# Altium project 100862_project.prjpcb (part 1 of 2)
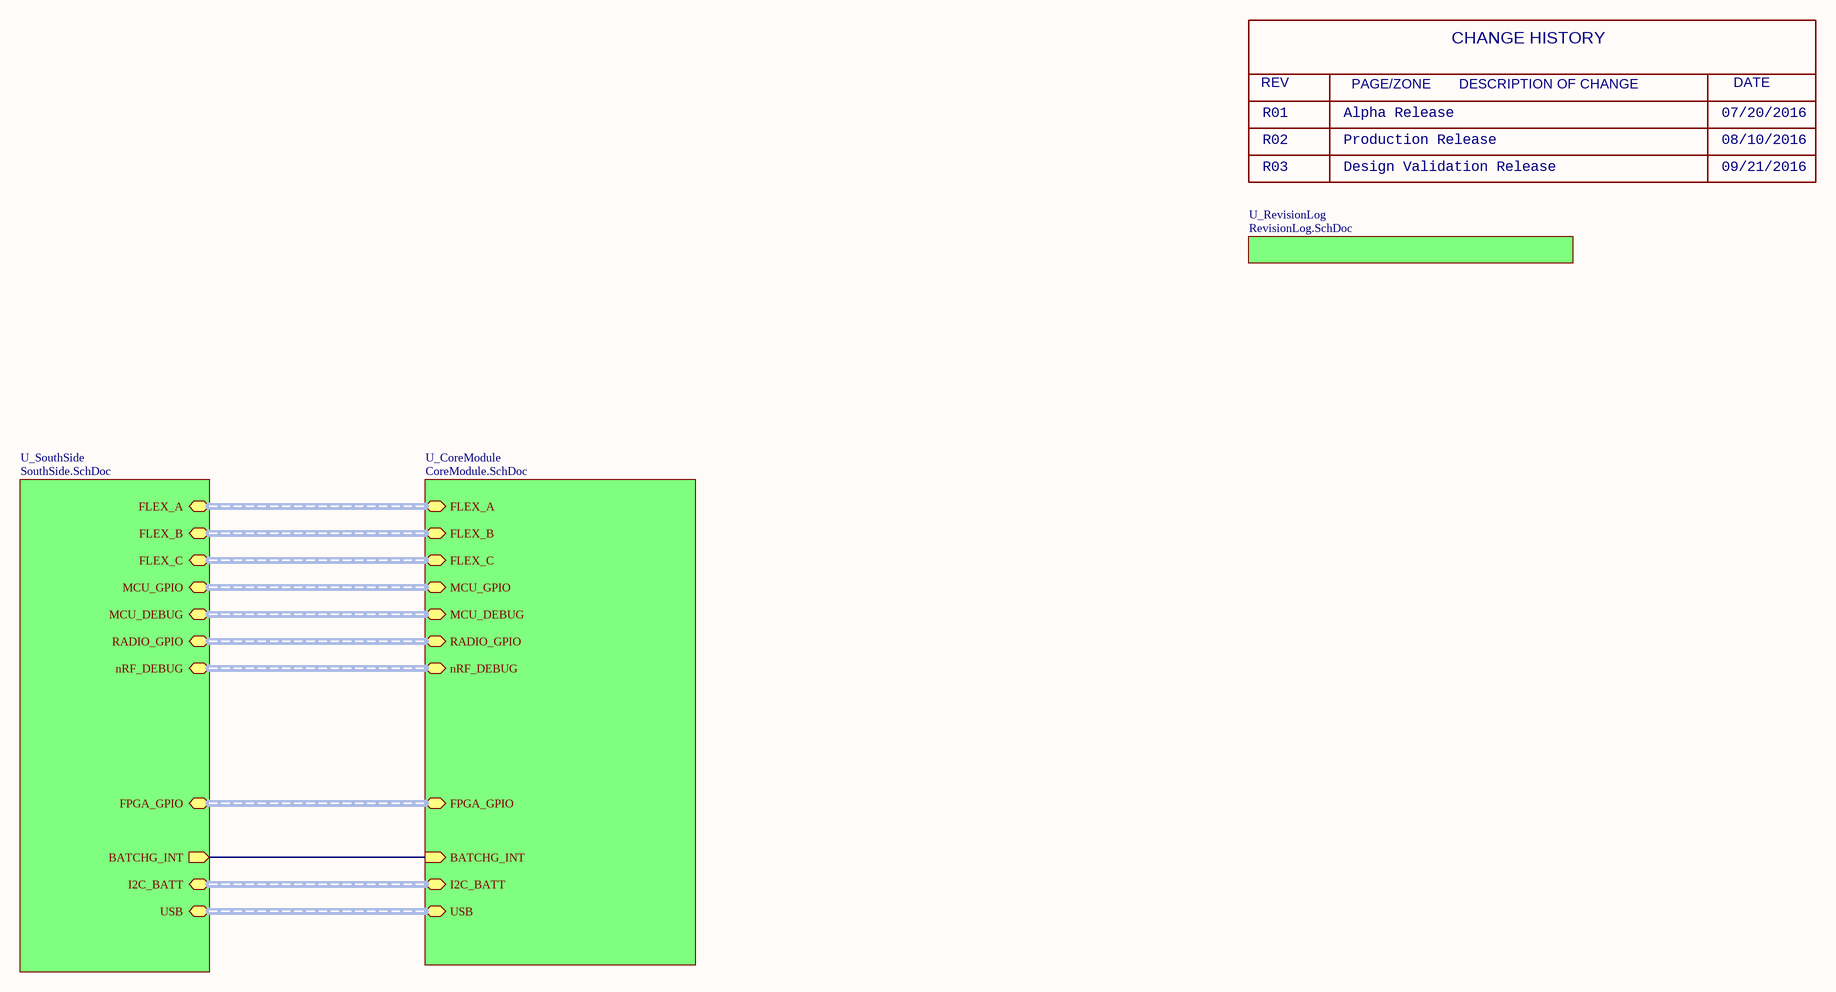
[diagram p0: EvmAppBoard.SchDoc]
Board_Name: EVM Application Board; Board_Number: 100862; PCB_Revision: 03; Project_Name: Ventriloquist; Sch_Revision: 03
7 sheets, 185 parts. Net scope: hierarchical (ports join the sheet entries above them; power ports are global).
Board file: 100862.PcbDoc
Sheets:
  EvmAppBoard.SchDoc
    U_CoreModule = CoreModule.SchDoc
    U_SouthSide = SouthSide.SchDoc
      U_Charging = Charging.SchDoc
      U_Regulation = Regulation.SchDoc
      U_Breakout = Breakout.SchDoc
    U_RevisionLog = RevisionLog.SchDoc

## Sheet EvmAppBoard.SchDoc: Block Diagram
size 431 x 279 mm; DrawnBy: D. Bruey, M. Ciuffo; Organization: Synapse Product Development, LLC.; Address1: 1511 6th Ave., Suite 400; Address2: Seattle, Washington 98101; Address3: 206.381.0898; Address4: www.synapse.com; DocumentNumber: 1; SheetNumber: 1; SheetTotal: 7; PageSetup: Record=PageOptions|CenterHorizontal=True|CenterVertical=True|PrintScale=1.06|XCorrection=1.00|YCorrection=1.00|PrintKind=1|BorderSize=5000000|LeftOffset=0|BottomOffset=0|Orientation=2|PaperLength=4318|PaperWidth=2794|Scale=100|PaperSource=7|PrintQuality=200|MediaType=1|DitherType=10|PrintScaleMode=1|PaperKind=11x17|PaperIndex=3

### Sub-sheets
U_CoreModule = CoreModule.SchDoc: I2C_BATT (harness I2C), MCU_DEBUG (harness SWD), nRF_DEBUG (harness SWD), USB (harness USB), MCU_GPIO (harness MCU_IO), FLEX_C (harness SPI), FLEX_B (harness SPI), FLEX_A (harness SPI), BATCHG_INT (in), FPGA_GPIO (harness FPGA_IO), RADIO_GPIO (harness RADIO_IO)
U_RevisionLog = RevisionLog.SchDoc: no entries
U_SouthSide = SouthSide.SchDoc: I2C_BATT (harness I2C), MCU_DEBUG (harness SWD), nRF_DEBUG (harness SWD), USB (harness USB), MCU_GPIO (harness MCU_IO), FLEX_C (harness SPI), FLEX_B (harness SPI), FLEX_A (harness SPI), BATCHG_INT (out), FPGA_GPIO (harness FPGA_IO), RADIO_GPIO (harness RADIO_IO)

### Nets
BATCHG_INT: sheet U_CoreModule/BATCHG_INT, sheet U_SouthSide/BATCHG_INT

### Buses and harness runs
harness sheet U_CoreModule/FLEX_A = sheet U_SouthSide/FLEX_A
harness sheet U_CoreModule/FLEX_B = sheet U_SouthSide/FLEX_B
harness sheet U_CoreModule/FLEX_C = sheet U_SouthSide/FLEX_C
harness sheet U_CoreModule/FPGA_GPIO = sheet U_SouthSide/FPGA_GPIO
harness sheet U_CoreModule/I2C_BATT = sheet U_SouthSide/I2C_BATT
harness sheet U_CoreModule/MCU_DEBUG = sheet U_SouthSide/MCU_DEBUG
harness sheet U_CoreModule/MCU_GPIO = sheet U_SouthSide/MCU_GPIO
harness sheet U_CoreModule/nRF_DEBUG = sheet U_SouthSide/nRF_DEBUG
harness sheet U_CoreModule/RADIO_GPIO = sheet U_SouthSide/RADIO_GPIO
harness sheet U_CoreModule/USB = sheet U_SouthSide/USB

### Notes on the sheet
- REV
- PAGE/ZONE       DESCRIPTION OF CHANGE
- CHANGE HISTORY
- DATE
- R01
- R02
- R03
- Alpha Release
- Production Release
- Design Validation Release
- 07/20/2016
- 08/10/2016
- 09/21/2016
- Design Notes:
- Layout Notes:
- Project:
- Sheet Title:
- PCBA:
- PROPRIETARY AND CONFIDENTIAL
- Drawn by:
- Schematic Part Number:
- Schematic Revision:
- Date:
- Sheet:
- /

## Sheet CoreModule.SchDoc: Core Module
size 431 x 279 mm; DrawnBy: D. Bruey, M. Ciuffo; Organization: Synapse Product Development, LLC.; Address1: 1511 6th Ave., Suite 400; Address2: Seattle, Washington 98101; Address3: 206.381.0898; Address4: www.synapse.com; SheetNumber: 2; SheetTotal: 7; PageSetup: Record=PageOptions|CenterHorizontal=True|CenterVertical=True|PrintScale=1.06|XCorrection=1.00|YCorrection=1.00|PrintKind=1|BorderSize=5000000|LeftOffset=0|BottomOffset=0|Orientation=2|PaperLength=4318|PaperWidth=2794|Scale=100|PaperSource=7|PrintQuality=200|MediaType=1|DitherType=10|PrintScaleMode=1|PaperKind=11x17|PaperIndex=3
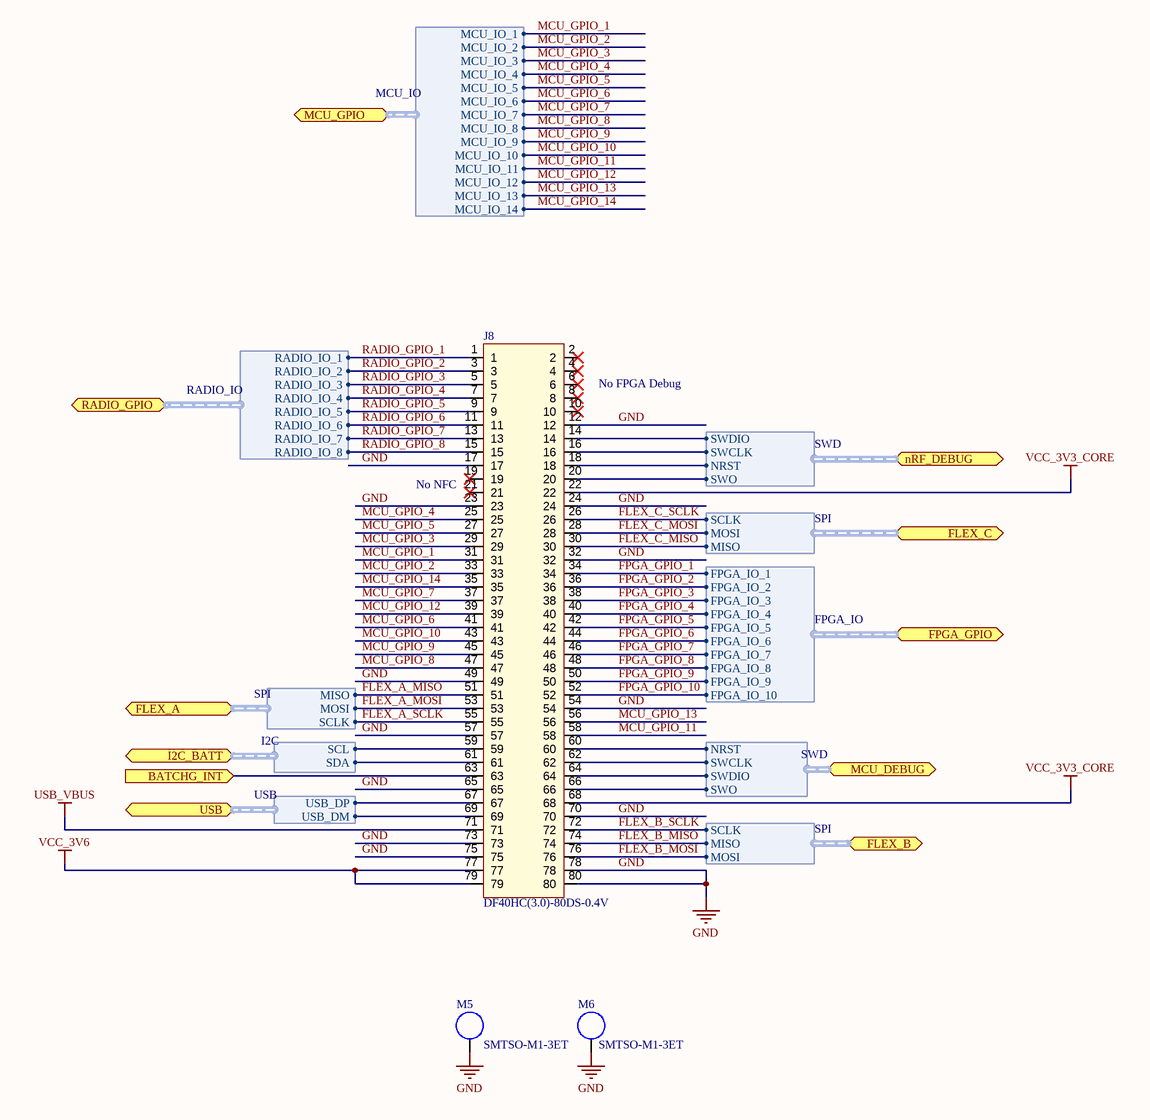
[diagram p1: CoreModule.SchDoc]

### Parts
J8  DF40HC(3.0)-80DS-0.4V  [con80_hirose-df40c-80ds_129h]
M5  SMTSO-M1-3ET  [standoff_hole2p50p]
M6  SMTSO-M1-3ET  [standoff_hole2p50p]

### Ports
BATCHG_INT (in), FLEX_A (harness SPI), FLEX_B (harness SPI), FLEX_C (harness SPI), FPGA_GPIO (harness FPGA_IO), I2C_BATT (harness I2C), MCU_DEBUG (harness SWD), MCU_GPIO (harness MCU_IO), nRF_DEBUG (harness SWD), RADIO_GPIO (harness RADIO_IO), USB (harness USB)

### Harnesses
SPI: MOSI, MISO, SCLK
USB: USB_DM, USB_DP
I2C: SDA, SCL
SWD: NRST, SWCLK, SWDIO, SWO
MCU_IO: MCU_IO_1, MCU_IO_2, MCU_IO_3, MCU_IO_4, MCU_IO_5, MCU_IO_6, MCU_IO_7, MCU_IO_8, MCU_IO_9, MCU_IO_10, MCU_IO_11, MCU_IO_12, MCU_IO_13, MCU_IO_14
FPGA_IO: FPGA_IO_2, FPGA_IO_3, FPGA_IO_4, FPGA_IO_5, FPGA_IO_6, FPGA_IO_7, FPGA_IO_8, FPGA_IO_9, FPGA_IO_10, FPGA_IO_1
RADIO_IO: RADIO_IO_1, RADIO_IO_2, RADIO_IO_3, RADIO_IO_4, RADIO_IO_5, RADIO_IO_6, RADIO_IO_7, RADIO_IO_8

### Nets
GND: J8.12 J8.17 J8.23 J8.24 J8.32 J8.49 J8.54 J8.57 J8.65 J8.70 J8.73 J8.75 J8.78 J8.80 M5.1 M6.1
USB_VBUS: J8.71
VCC_3V3_CORE: J8.22 J8.68
VCC_3V6: J8.77 J8.79
BATCHG_INT: J8.63 ; port BATCHG_INT
FLEX_A_MISO: J8.51 ; port FLEX_A.MISO
FLEX_A_MOSI: J8.53 ; port FLEX_A.MOSI
FLEX_A_SCLK: J8.55 ; port FLEX_A.SCLK
FLEX_B_MISO: J8.74 ; port FLEX_B.MISO
FLEX_B_MOSI: J8.76 ; port FLEX_B.MOSI
FLEX_B_SCLK: J8.72 ; port FLEX_B.SCLK
FLEX_C_MISO: J8.30 ; port FLEX_C.MISO
FLEX_C_MOSI: J8.28 ; port FLEX_C.MOSI
FLEX_C_SCLK: J8.26 ; port FLEX_C.SCLK
FPGA_GPIO_1: J8.34 ; port FPGA_GPIO.FPGA_IO_1
FPGA_GPIO_2: J8.36 ; port FPGA_GPIO.FPGA_IO_2
FPGA_GPIO_3: J8.38 ; port FPGA_GPIO.FPGA_IO_3
FPGA_GPIO_4: J8.40 ; port FPGA_GPIO.FPGA_IO_4  [project net 3V3_APP_nEN]
FPGA_GPIO_5: J8.42 ; port FPGA_GPIO.FPGA_IO_5
FPGA_GPIO_6: J8.44 ; port FPGA_GPIO.FPGA_IO_6
FPGA_GPIO_7: J8.46 ; port FPGA_GPIO.FPGA_IO_7
FPGA_GPIO_8: J8.48 ; port FPGA_GPIO.FPGA_IO_8
FPGA_GPIO_9: J8.50 ; port FPGA_GPIO.FPGA_IO_9
FPGA_GPIO_10: J8.52 ; port FPGA_GPIO.FPGA_IO_10
MCU_GPIO_1: J8.31 ; port MCU_GPIO.MCU_IO_1
MCU_GPIO_2: J8.33 ; port MCU_GPIO.MCU_IO_2
MCU_GPIO_3: J8.29 ; port MCU_GPIO.MCU_IO_3  [project net BTN_SYS_MCU]
MCU_GPIO_4: J8.25 ; port MCU_GPIO.MCU_IO_4
MCU_GPIO_5: J8.27 ; port MCU_GPIO.MCU_IO_5
MCU_GPIO_6: J8.41 ; port MCU_GPIO.MCU_IO_6
MCU_GPIO_7: J8.37 ; port MCU_GPIO.MCU_IO_7
MCU_GPIO_8: J8.47 ; port MCU_GPIO.MCU_IO_8
MCU_GPIO_9: J8.45 ; port MCU_GPIO.MCU_IO_9
MCU_GPIO_10: J8.43 ; port MCU_GPIO.MCU_IO_10
MCU_GPIO_11: J8.58 ; port MCU_GPIO.MCU_IO_11  [project net MCU_11/FLASH_NCS]
MCU_GPIO_12: J8.39 ; port MCU_GPIO.MCU_IO_12
MCU_GPIO_13: J8.56 ; port MCU_GPIO.MCU_IO_13
MCU_GPIO_14: J8.35 ; port MCU_GPIO.MCU_IO_14
MCU_nRST: J8.60 ; port MCU_DEBUG.NRST
MCU_SWCLK: J8.62 ; port MCU_DEBUG.SWCLK
MCU_SWDIO: J8.64 ; port MCU_DEBUG.SWDIO
MCU_SWO: J8.66 ; port MCU_DEBUG.SWO
RADIO_GPIO_1: J8.1 ; port RADIO_GPIO.RADIO_IO_1
RADIO_GPIO_2: J8.3 ; port RADIO_GPIO.RADIO_IO_2
RADIO_GPIO_3: J8.5 ; port RADIO_GPIO.RADIO_IO_3
RADIO_GPIO_4: J8.7 ; port RADIO_GPIO.RADIO_IO_4
RADIO_GPIO_5: J8.9 ; port RADIO_GPIO.RADIO_IO_5
RADIO_GPIO_6: J8.11 ; port RADIO_GPIO.RADIO_IO_6
RADIO_GPIO_7: J8.13 ; port RADIO_GPIO.RADIO_IO_7
RADIO_GPIO_8: J8.15 ; port RADIO_GPIO.RADIO_IO_8
RADIO_nRST: J8.18 ; port nRF_DEBUG.NRST
RADIO_SWCLK: J8.16 ; port nRF_DEBUG.SWCLK
RADIO_SWDIO: J8.14 ; port nRF_DEBUG.SWDIO
RADIO_SWO: J8.20 ; port nRF_DEBUG.SWO
SCL: J8.59 ; port I2C_BATT.SCL
SDA: J8.61 ; port I2C_BATT.SDA
USB_D_N: J8.69 ; port USB.USB_DM
USB_D_P: J8.67 ; port USB.USB_DP

Not connected (* = marked no-connect by the designer): J8 2* 4* 6* 8* 10* 19* 21*

### Notes on the sheet
- (near J8) No FPGA Debug
- (near J8) No NFC
- Design Notes:
- Layout Notes:
- Project:
- Sheet Title:
- PCBA:
- PROPRIETARY AND CONFIDENTIAL
- Drawn by:
- Schematic Part Number:
- Schematic Revision:
- Date:
- Sheet:
- /

### Library data of the parts
J8 = DF40HC(3.0)-80DS-0.4V(51): CONN RCPT 80POS 0.4MM SMD GOLD 3.0MM; part_type: connector; id: 1591; mfg: Hirose; dist: Mouser; dist_pn: 798-DF40HC3080D04V51; source_package: DF40C-80DS-0.4V(51); voltage: 30V; positions: 80; TableName: viewAltiumConnectors; mfg_pn: DF40HC(3.0)-80DS-0.4V(51); height: 3.0mm; status: Unknown; datasheet: http://www.hirose.co.jp/cataloge_hp/ed_DF40_20140305.pdf
M5 M6 = SMTSO-M1-3ET: SMT mounted PEM Standoff, M1, length 3mm; part_type: mounting; id: 1166; mfg: Penn Engineering; dist: Hi-Tech Fasteners; TableName: viewAltiumMisc; mfg_pn: SMTSO-M1-3ET; dist_pn: SMTSO-M1-3ET; status: Unknown

## Sheet SouthSide.SchDoc: South Side Connector
size 431 x 279 mm; DrawnBy: D. Bruey, M. Ciuffo; Organization: Synapse Product Development, LLC.; Address1: 1511 6th Ave., Suite 400; Address2: Seattle, Washington 98101; Address3: 206.381.0898; Address4: www.synapse.com; DocumentNumber: 12; SheetNumber: 3; SheetTotal: 7; PageSetup: Record=PageOptions|CenterHorizontal=True|CenterVertical=True|PrintScale=0.95|XCorrection=1.00|YCorrection=1.00|PrintKind=1|BorderSize=5000000|LeftOffset=0|BottomOffset=0|Orientation=2|PaperLength=4318|PaperWidth=2794|Scale=100|PaperSource=7|PrintQuality=200|MediaType=1|DitherType=10|PrintScaleMode=1|PaperKind=11x17|PaperIndex=3
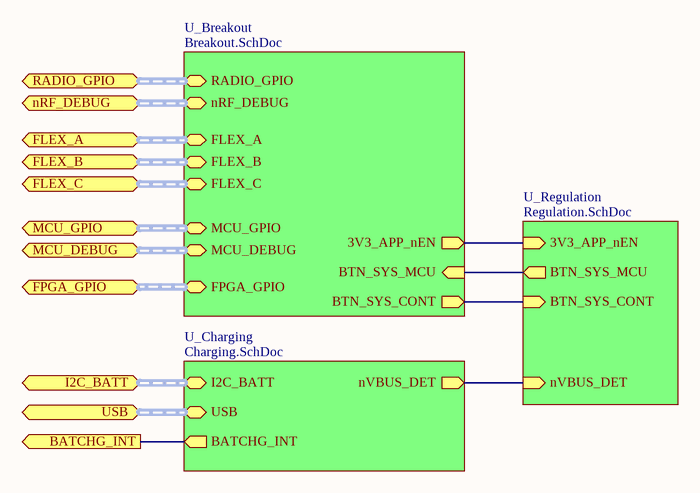
[diagram p2: SouthSide.SchDoc]

### Sub-sheets
U_Breakout = Breakout.SchDoc: FLEX_A (harness SPI), FLEX_B (harness SPI), FLEX_C (harness SPI), MCU_GPIO (harness MCU_IO), MCU_DEBUG (harness SWD), FPGA_GPIO (harness FPGA_IO), nRF_DEBUG (harness SWD), RADIO_GPIO (harness RADIO_IO), BTN_SYS_CONT (out), BTN_SYS_MCU (in), 3V3_APP_nEN (out)
U_Charging = Charging.SchDoc: I2C_BATT (harness I2C), USB (harness USB), BATCHG_INT (out), nVBUS_DET (out)
U_Regulation = Regulation.SchDoc: nVBUS_DET (in), BTN_SYS_CONT (in), BTN_SYS_MCU (out), 3V3_APP_nEN (in)

### Ports
BATCHG_INT (out), FLEX_A (harness SPI), FLEX_B (harness SPI), FLEX_C (harness SPI), FPGA_GPIO (harness FPGA_IO), I2C_BATT (harness I2C), MCU_DEBUG (harness SWD), MCU_GPIO (harness MCU_IO), nRF_DEBUG (harness SWD), RADIO_GPIO (harness RADIO_IO), USB (harness USB)

### Nets
3V3_APP_nEN: sheet U_Regulation/3V3_APP_nEN, sheet U_Breakout/3V3_APP_nEN
BATCHG_INT: port BATCHG_INT, sheet U_Charging/BATCHG_INT
BTN_SYS_CONT: sheet U_Regulation/BTN_SYS_CONT, sheet U_Breakout/BTN_SYS_CONT
BTN_SYS_MCU: sheet U_Regulation/BTN_SYS_MCU, sheet U_Breakout/BTN_SYS_MCU
nVBUS_DET: sheet U_Charging/nVBUS_DET, sheet U_Regulation/nVBUS_DET

### Buses and harness runs
harness port FLEX_A = sheet U_Breakout/FLEX_A
harness port FLEX_B = sheet U_Breakout/FLEX_B
harness port FLEX_C = sheet U_Breakout/FLEX_C
harness port FPGA_GPIO = sheet U_Breakout/FPGA_GPIO
harness port I2C_BATT = sheet U_Charging/I2C_BATT
harness port MCU_DEBUG = sheet U_Breakout/MCU_DEBUG
harness port MCU_GPIO = sheet U_Breakout/MCU_GPIO
harness port nRF_DEBUG = sheet U_Breakout/nRF_DEBUG
harness port RADIO_GPIO = sheet U_Breakout/RADIO_GPIO
harness port USB = sheet U_Charging/USB

### Notes on the sheet
- Design Notes:
- Layout Notes:
- Project:
- Sheet Title:
- PCBA:
- PROPRIETARY AND CONFIDENTIAL
- Drawn by:
- Schematic Part Number:
- Schematic Revision:
- Date:
- Sheet:
- /

## Sheet Charging.SchDoc: Charging
size 431 x 279 mm; DrawnBy: D. Bruey, M. Ciuffo; Organization: Synapse Product Development, LLC.; Address1: 1511 6th Ave., Suite 400; Address2: Seattle, Washington 98101; Address3: 206.381.0898; Address4: www.synapse.com; DocumentNumber: 13; SheetNumber: 5; SheetTotal: 7; PageSetup: Record=PageOptions|CenterHorizontal=True|CenterVertical=True|PrintScale=1.06|XCorrection=1.00|YCorrection=1.00|PrintKind=1|BorderSize=5000000|LeftOffset=0|BottomOffset=0|Orientation=2|PaperLength=4318|PaperWidth=2794|Scale=100|PaperSource=7|PrintQuality=200|MediaType=1|DitherType=10|PrintScaleMode=1|PaperKind=11x17|PaperIndex=3
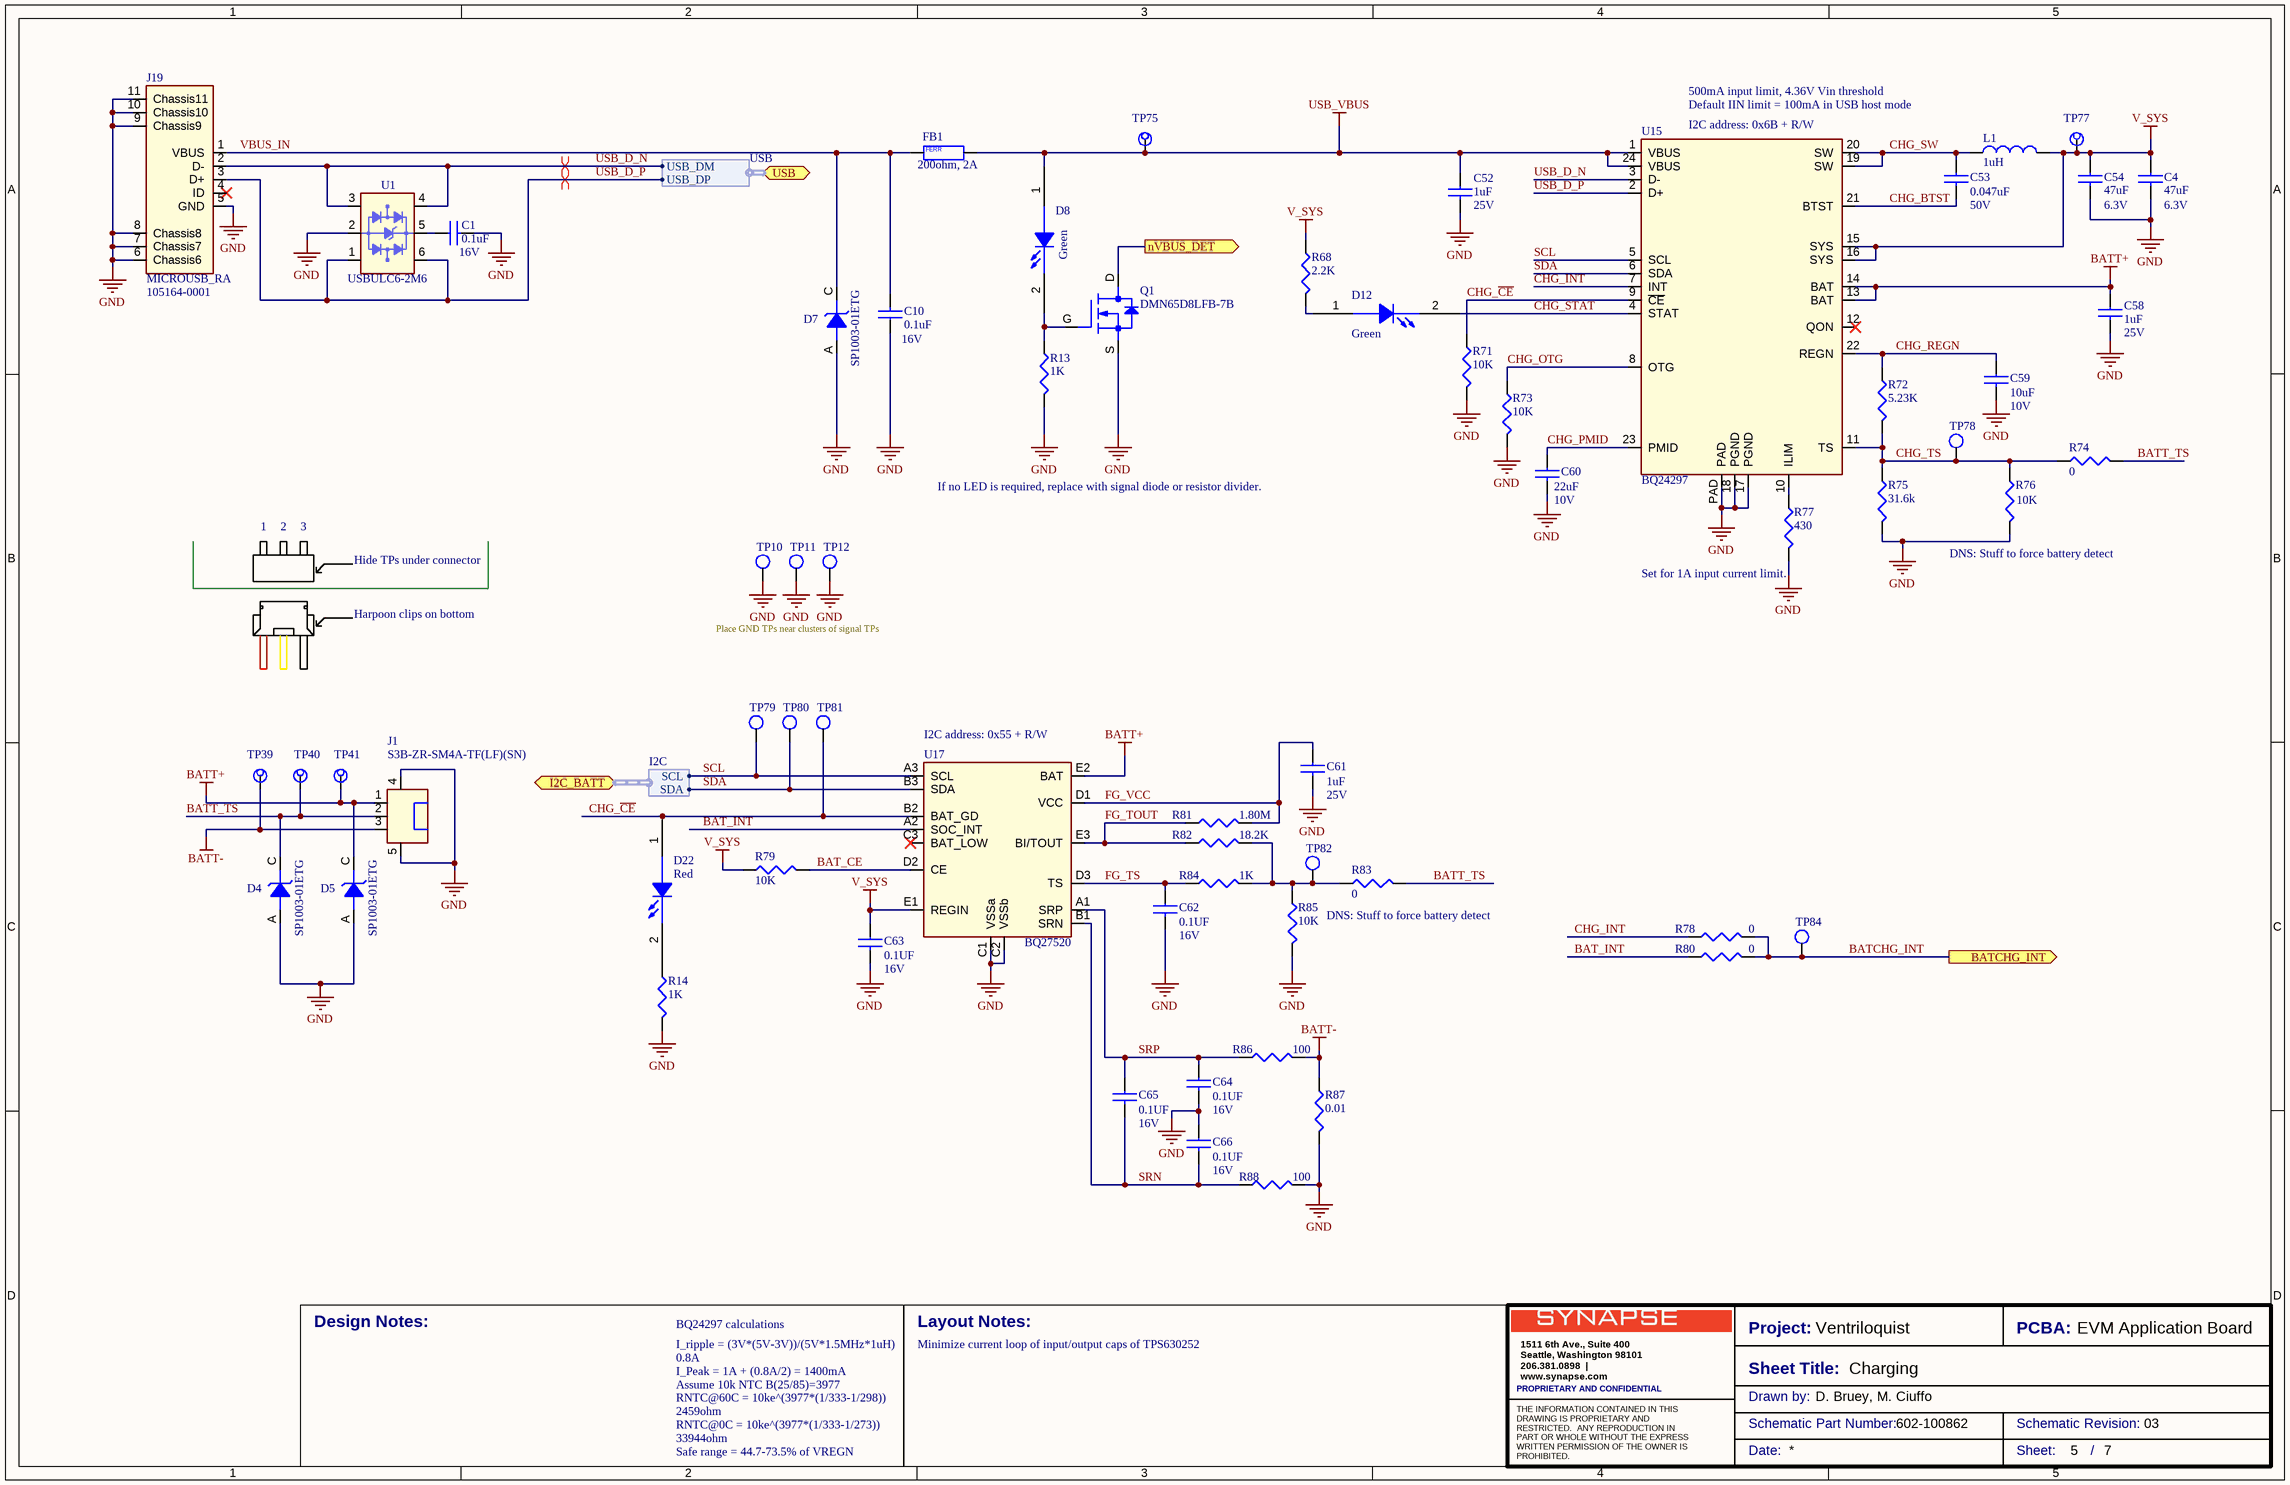
[diagram p3: Charging.SchDoc]

### Parts
C1  0.1uF  Voltage: 16V  [0402-IPCsm_55]
C4  47uF  Voltage: 6.3V  [0805-ipcsm_145]
C10  0.1uF  Voltage: 16V  [0402-IPCsm_55]
C52  1uF  Voltage: 25V  [0603-IPCsm_90]
C53  0.047uF  Voltage: 50V  [0402-IPCsm_55]
C54  47uF  Voltage: 6.3V  [0805-ipcsm_145]
C58  1uF  Voltage: 25V  [0603-IPCsm_90]
C59  10uF  Voltage: 10V  [0402-ipcsm_55]
C60  22uF  Voltage: 10V  [0805-IPCsm_100]
C61  1uF  Voltage: 25V  [0603-IPCsm_90]
C62  0.1UF  Voltage: 16V  [0603-ipcsm_90]
C63  0.1UF  Voltage: 16V  [0603-ipcsm_90]
C64  0.1UF  Voltage: 16V  [0603-ipcsm_90]
C65  0.1UF  Voltage: 16V  [0603-ipcsm_90]
C66  0.1UF  Voltage: 16V  [0603-ipcsm_90]
D4  SP1003-01ETG  [SOD882-60]
D5  SP1003-01ETG  [SOD882-60]
D7  SP1003-01ETG  [SOD882-60]
D8  Green  [led_ltst-c191kgkt_s80]
D12  Green  [led_ltst-c191kgkt_s80]
D22  Red  [LED_LTST-C191KGKT_S80]
FB1  200ohm, 2A  [ind-0603_38H]
J1  S3B-ZR-SM4A-TF(LF)(SN)  [CON_JST_S3B-ZR-SM4A]
J19  MICROUSB_RA  mfg_pn: 105164-0001  [CON_USB_MOLEX_105164-0001]
L1  1uH  [ind-1008_35H]
Q1  DMN65D8LFB-7B  [DFN3-1006_50H]
R13  1K  [0603-IPCsm_56]
R14  1K  [0603-IPCsm_56]
R68  2.2K  [0402-IPCsm_40]
R71  10K  [0402-IPCsm_40]
R72  5.23K  [0402-IPCsm_40]
R73  10K  [0402-IPCsm_40]
R74  0  [0402-IPCsm_40]
R75  31.6k  [0402-IPCsm_40]
R76  10K  [0402-IPCsm_40]
R77  430  [0402-IPCsm_40]
R78  0  [0402-IPCsm_40]
R79  10K  [0402-IPCsm_40]
R80  0  [0402-IPCsm_40]
R81  1.80M  [0603-IPCsm_56]
R82  18.2K  [0603-IPCsm_56]
R83  0  [0402-IPCsm_40]
R84  1K  [0603-IPCsm_56]
R85  10K  [0402-IPCsm_40]
R86  100  [0603-IPCsm_56]
R87  0.01  [r-0805_20H]
R88  100  [0603-IPCsm_56]
TP10  tp-1mm  [TP-S100_SMT]  (value not drawn)  (no BOM)
TP11  tp-1mm  [TP-S100_SMT]  (value not drawn)  (no BOM)
TP12  tp-1mm  [TP-S100_SMT]  (value not drawn)  (no BOM)
TP39  TPC150H080P  [TPC150H080P]  (value not drawn)  (no BOM)
TP40  TPC150H080P  [TPC150H080P]  (value not drawn)  (no BOM)
TP41  TPC150H080P  [TPC150H080P]  (value not drawn)  (no BOM)
TP75  TPC150H080P  [TPC150H080P]  (value not drawn)  (no BOM)
TP77  TPC150H080P  [TPC150H080P]  (value not drawn)  (no BOM)
TP78  tp-1mm  [TP-S100_SMT]  (value not drawn)  (no BOM)
TP79  tp-1mm  [TP-S100_SMT]  (value not drawn)  (no BOM)
TP80  tp-1mm  [TP-S100_SMT]  (value not drawn)  (no BOM)
TP81  tp-1mm  [TP-S100_SMT]  (value not drawn)  (no BOM)
TP82  tp-1mm  [TP-S100_SMT]  (value not drawn)  (no BOM)
TP84  tp-1mm  [TP-S100_SMT]  (value not drawn)  (no BOM)
U1  USBULC6-2M6  [UQFN6_ USBULC6-2M6]
U15  BQ24297  [QFN24_BQ24297RGE]
U17  BQ27520  [BGA15_BQ27520YZFR]

### Ports
BATCHG_INT (out), I2C_BATT (harness I2C), nVBUS_DET (out), USB (harness USB)

### Harnesses
USB: USB_DM, USB_DP
I2C: SCL, SDA

### Nets
BATT+: C58.1 D5.C J1.1 TP41.1(TP) U15.13(BAT) U15.14(BAT) U17.E2(BAT)
BATT-: J1.3 R86.2 R87.1 TP39.1(TP)
GND: C1.2 C4.2 C10.1 C52.2 C54.2 C58.2 C59.2 C60.2 C61.2 C62.2 C63.2 C64.2 C66.1 D4.A D5.A D7.A J1.4(TAB1) J1.5(TAB2) J19.5(GND) J19.6(Chassis6) J19.7(Chassis7) J19.8(Chassis8) J19.9(Chassis9) J19.10(Chassis10) J19.11(Chassis11) Q1.S R13.2 R14.2 R71.2 R73.2 R75.2 R76.2 R77.2 R85.2 R87.2 R88.2 TP10.1(TP) TP11.1(TP) TP12.1(TP) U1.2(GND) U15.17(PGND) U15.18(PGND) U15.PAD U17.C1(VSSa) U17.C2(VSSb)
USB_VBUS: C52.1 D8.1(A) FB1.1(ENDA) TP75.1(TP) U15.1(VBUS) U15.24(VBUS)
V_SYS: C4.1 C54.1 C63.1 L1.2 R68.1 R79.1 TP77.1(TP) U15.15(SYS) U15.16(SYS) U17.E1(REGIN)
BAT_CE: R79.2 U17.D2(CE)
BAT_INT: R80.1 U17.A2(SOC_INT)
BATCHG_INT: R78.2 R80.2 TP84.1(TP) ; port BATCHG_INT
BATT_TS: D4.C J1.2 R74.2 R83.2 TP40.1(TP)
CHG_BTST: C53.2 U15.21(BTST)
CHG_~{CE}: D22.1(A) R71.1 TP81.1(TP) U15.9(~{CE}) U17.B2(BAT_GD)
CHG_INT: R78.1 U15.7(INT)
CHG_OTG: R73.1 U15.8(OTG)
CHG_PMID: C60.1 U15.23(PMID)
CHG_REGN: C59.1 R72.1 U15.22(REGN)
CHG_STAT: D12.2(C) U15.4(STAT)
CHG_SW: C53.1 L1.1 U15.19(SW) U15.20(SW)
CHG_TS: R72.2 R74.1 R75.1 R76.1 TP78.1(TP) U15.11(TS)
FG_TOUT: R81.2 R82.2 U17.E3(BI/TOUT)
FG_TS: C62.1 R84.1 U17.D3(TS)
FG_VCC: C61.1 R81.1 U17.D1(VCC)
nVBUS_DET: Q1.D ; port nVBUS_DET
SCL: TP79.1(TP) U15.5(SCL) U17.A3(SCL) ; port I2C_BATT.SCL
SDA: TP80.1(TP) U15.6(SDA) U17.B3(SDA) ; port I2C_BATT.SDA
SRN: C65.2 C66.2 R88.1 U17.B1(SRN)
SRP: C64.1 C65.1 R86.1 U17.A1(SRP)
USB_D_N: J19.2(D-) U1.3(I/O2) U1.4(I/O3) U15.3(D-) ; port USB.USB_DM
USB_D_P: J19.3(D+) U1.1(I/O1) U1.6(I/O4) U15.2(D+) ; port USB.USB_DP
VBUS_IN: C10.2 D7.C FB1.2(ENDB) J19.1(VBUS)
NetC1_1: C1.1 U1.5(VDD)
NetD8_2: D8.2(C) Q1.G R13.1
NetD12_1: D12.1(A) R68.2
NetD22_2: D22.2(C) R14.1
NetR77_1: R77.1 U15.10(ILIM)
NetR82_1: R82.1 R83.1 R84.2 R85.1 TP82.1(TP)

Not connected (* = marked no-connect by the designer): J19 4(ID)*; U15 12(QON)*; U17 C3(BAT_LOW)*

### Layout directives
differential pair: USB_D_N, USB_D_P

### Notes on the sheet
- 500mA input limit, 4.36V Vin threshold
- Default IIN limit = 100mA in USB host mode
- (near U15) I2C address: 0x6B + R/W
- If no LED is required, replace with signal diode or resistor divider.
- 1
- 2
- 3
- Hide TPs under connector
- (near R76) DNS: Stuff to force battery detect
- Harpoon clips on bottom
- Place GND TPs near clusters of signal TPs
- (near R77) Set for 1A input current limit.
- (near U17) I2C address: 0x55 + R/W
- DNS: Stuff to force battery detect
- BQ24297 calculations
- I_ripple = (3V*(5V-3V))/(5V*1.5MHz*1uH)
- 0.8A
- I_Peak = 1A + (0.8A/2) = 1400mA
- Minimize current loop of input/output caps of TPS630252
- Assume 10k NTC B(25/85)=3977
- 2459ohm
- RNTC@60C = 10ke^(3977*(1/333-1/298))
- RNTC@0C = 10ke^(3977*(1/333-1/273))
- 33944ohm
- Safe range = 44.7-73.5% of VREGN
- Design Notes:
- Layout Notes:
- Project:
- Sheet Title:
- PCBA:
- PROPRIETARY AND CONFIDENTIAL
- Drawn by:
- Schematic Part Number:
- Schematic Revision:
- Date:
- Sheet:
- /
- (in symbol MPZ1608S221A) FERR

### Library data of the parts
C1 C10 = GRM155R71C104KA88D: CAP CER .1UF 16V X7R 0402; part_type: capacitor; id: 588; mfg: MURATA; dist: DIGIKEY; dist_pn: 490-3261-1-ND; source_package: C_0P1U_16V_X7R_0402; tolerance: 10%; TableName: viewAltiumCapacitors; mfg_pn: GRM155R71C104KA88D; type: X7R; height: 0.55MM; status: Unknown
C4 C54 = C2012X5R0J476M125AC: CAP CER 47UF 6.3V 20% X5R 0805; part_type: capacitor; id: 1352; mfg: TDK; dist: DIGIKEY; dist_pn: 445-8239-1-ND; TableName: viewAltiumCapacitors; mfg_pn: C2012X5R0J476M125AC; tolerance: 20%; height: 1.45MM; status: Unknown
C52 C58 C61 = GRM188R61E105KA12D: CAP CER 1UF 25V 10% X5R 0603; part_type: capacitor; id: 563; mfg: Murata; dist: Digikey; dist_pn: 490-3897-1-ND; TableName: viewAltiumCapacitors; mfg_pn: GRM188R61E105KA12D; type: X5R; tolerance: 10%; height: 0.9MM; status: Good
C53 = C1005X7R1H473K050BB: CAP CER 0.047UF 50V 10% X7R 0402; part_type: capacitor; id: 1196; mfg: TDK; dist: DIGIKEY; dist_pn: 445-7336-1-ND; TableName: viewAltiumCapacitors; mfg_pn: C1005X7R1H473K050BB; type: X7R; tolerance: 10%; height: 0.55MM; status: Unknown
C59 = CL05A106MP5NUNC: CAP CER 10UF 10V 20% X5R 0402; part_type: capacitor; id: 1055; mfg: Samsung Electro-Mechanics America, Inc; dist: DIGIKEY; dist_pn: 1276-1450-6-ND; source_package: C_10uF_10V_X5R_0402; TableName: viewAltiumCapacitors; mfg_pn: CL05A106MP5NUNC; type: X5R; tolerance: 20%; height: 0.55mm; status: Unknown
C60 = C2012JB1A226M085AC: CAP CER 22UF 10V 20% JB 0805; part_type: capacitor; id: 1097; mfg: TDK; dist: DIGIKEY; dist_pn: 445-11411-1-ND; source_package: C_22u_10V_JB_0805; TableName: viewAltiumCapacitors; mfg_pn: C2012JB1A226M085AC; type: JB; tolerance: 20%; height: 1.00MM; status: Unknown
C62-C66 = C0603C104J4RACTU: CAP CER 0.1UF 16V 5% X7R 0603; part_type: capacitor; id: 1053; mfg: Kemet; dist: Digi-Key; dist_pn: 399-1097-1-ND; source_package: C_0U1_16V_X7R_0603; TableName: viewAltiumCapacitors; mfg_pn: C0603C104J4RACTU; type: X7R; height: 0.87MM; status: Unknown; tolerance: 5%
D4 D5 D7 = SP1003-01ETG: TVS DIODE 5VWM 12VC SOD882; id: 1282; mfg: Littelfuse Inc.; dist: Digikey; dist_pn: F4088CT-ND; TableName: viewAltiumDiscretes; mfg_pn: SP1003-01ETG; part_type: tvs; type: TVS; height: 0.60mm; status: Unknown
D8 D12 = LTST-C191KGKT: LED GREEN CLEAR THIN 0603 SMD; part_type: Discretes; id: 1137; mfg: Lite-On Inc; dist: Digikey; dist_pn: 160-1446-1-ND; voltage: 3.2V; current: 20mA; TableName: viewAltiumDiscretes; layout_notes: symbol now has A/C pins instead of 1/2, check footprint accordingly.; mfg_pn: LTST-C191KGKT; source_package: LTST-C191KGKT; status: Good; height: 0.55mm; type: LED
D22 = LTST-C191KRKT: LED RED CLEAR 0603 SMD; part_type: Discretes; id: 1235; mfg: Lite-On Inc; dist: Digikey; dist_pn: 160-1447-1-ND; voltage: 2V; current: 20mA; TableName: viewAltiumDiscretes; layout_notes: symbol now has A/C pins instead of 1/2, check footprint accordingly.; mfg_pn: LTST-C191KRKT; source_package: LTST-C191KRKT; type: LED; height: 0.55mm; status: Unknown
FB1 = MPZ1608S221A: FERRITE CHIP 220 OHM 2A 0603; part_type: ferrite_bead; id: 462; mfg: TDK Corporation; dist: Digikey; dist_pn: 445-1565-1-ND; source_package: BLM18PG300SN1D; TableName: viewAltiumInductors; mfg_pn: MPZ1608S221A; height: 0.8MM; status: Unknown
J1 = S3B-ZR-SM4A-TF(LF)(SN): 3 Positions Header, Shrouded Connector 0.059" (1.50mm) Surface Mount, Right Angle Tin; id: 1655; mfg: JST Sales America Inc; dist: DIGIKEY; dist_pn: 455-1694-2-ND; positions: 3; TableName: viewAltiumConnectors; mfg_pn: S3B-ZR-SM4A-TF(LF)(SN); part_type: connector; height: 3.7mm; status: Unknown
J19 = 105164-0001: USB - micro B Receptacle Connector 5 Position Surface Mount, Right Angle, Horizontal; id: 1627; mfg: MOLEX; dist: DIGIKEY; dist_pn: WM11263CT-ND; positions: 5; TableName: viewAltiumConnectors; part_type: usb; source_package: USB_MICRO; status: Unknown; datasheet: http://www.molex.com/pdm_docs/sd/1051640001_sd.pdf
L1 = LQM2HPN1R0MG0L: INDUCTOR 1.0UH 20% 1600MA 1008; id: 437; mfg: MURATA; dist: DIGIKEY; dist_pn: 490-5112-1-ND; TableName: viewAltiumInductors; mfg_pn: LQM2HPN1R0MG0L; part_type: inductor; height: 0.80MM; status: Unknown; Tolerance: 20%
Q1 = DMN65D8LFB-7B: MOSFET N-CH 60V 260MA 3DFN; part_type: fet; id: 1268; mfg: Diodes; dist: Digikey; dist_pn: DMN65D8LFB-7BDICT-ND; type: NFET; TableName: viewAltiumDiscretes; mfg_pn: DMN65D8LFB-7B; voltage: 60V; current: 260mA; status: Unknown
R13 R14 R84 = RC0603FR-071KL: RES 1K 1/10W 1% 0603 SMD; part_type: resistor; Tolerance: 1.00%; Voltage: 50V; DIST: Digikey; MFG: Yageo; DIST_PN: 311-1.00KHRTR-ND; Power: 0.1W; id: 1277; source_package: R_1K_0.1P_0603; TableName: viewAltiumResistors; Type: "; Height: 0.5MM; MFG_PN: RC0603FR-071KL; status: Unknown
R68 = ERJ-2GEJ222X: RES SMD 2.2K OHM 5% 1/10W 0402; part_type: resistor; Tolerance: 5.00%; Voltage: 50V; DIST: DIGIKEY; MFG: PANASONIC; DIST_PN: P2.2KJCT-ND; Power: 0.1W; id: 1545; source_package: R_2P2K_5P_0402; TableName: viewAltiumResistors; Height: .4MM; MFG_PN: ERJ-2GEJ222X; status: Unknown
R71 R73 R76 R79 R85 = ERJ-2GEJ103X: RES 10K OHM 1/10W 5% 0402 SMD; part_type: resistor; DIST: Digikey; MFG: Panasonic; DIST_PN: P10KJCT-ND; id: 2252; source_package: R_10K_5P_0402; TableName: viewAltiumResistors; Tolerance: 5%; Height: 0.4mm; MFG_PN: ERJ-2GEJ103X; status: Unknown
R72 = ERJ-2RKF5231X: RES 5.23K OHM 1/10W 1% 0402 SMD; part_type: resistor; Tolerance: 1.00%; DIST: DIGIKEY; MFG: PANASONIC; DIST_PN: P5.23KLCT-ND; Power: 0.1W; id: 1680; TableName: viewAltiumResistors; Height: .35MM; MFG_PN: ERJ-2RKF5231X; source_package: RES; status: Unknown
R74 R78 R80 R83 = ERJ-2GE0R00X: RES 0.0 OHM 1/10W JUMP 0402 SMD; part_type: resistor; Tolerance: 5.00%; DIST: DIGIKEY; MFG: PANASONIC; DIST_PN: P0.0JDKR-ND; Power: 0.063W; id: 1129; source_package: R_0_5P_0402; TableName: viewAltiumResistors; Height: 0.4MM; MFG_PN: ERJ-2GE0R00X; status: Unknown
R75 = ERJ-2RKF3162X: RES 31.6K OHM 0.1W 1% 0402 SMD; part_type: resistor; Tolerance: 1.00%; DIST: DIGIKEY; MFG: PANASONIC; DIST_PN: P31.6KLCT-ND; id: 2198; source_package: R_10K_1P_0402; TableName: viewAltiumResistors; Height: 0.4mm; MFG_PN: ERJ-2RKF3162X; Power: 0.1W; status: Unknown
R77 = ERJ-2RKF4300X: RES 430 OHM 1/10W 1% 0402 SMD; part_type: resistor; Tolerance: 1.00%; DIST: DIGIKEY; MFG: PANASONIC; DIST_PN: P430LCT-ND; Power: 0.063W; id: 2096; source_package: R_430_1P_0402; TableName: viewAltiumResistors; Height: 0.4mm; MFG_PN: ERJ-2RKF4300X; status: Unknown
R81 = ERJ-3EKF1804V: RES 1.80M OHM 1/10W 1% 0603 SMD; part_type: resistor; Tolerance: 1.00%; DIST: DIGIKEY; MFG: PANASONIC; DIST_PN: P1.80MHCT-ND; Power: 0.1W; id: 1978; source_package: R_1M80_1P_0603; TableName: viewAltiumResistors; Height: .55MM; MFG_PN: ERJ-3EKF1804V; status: Unknown
R82 = ERJ-3EKF1822V: RES 18.2K OHM 1/10W 1% 0603 SMD; part_type: resistor; Tolerance: 1.00%; DIST: DIGIKEY; MFG: PANASONIC; DIST_PN: P18.2KHCT-ND; Power: 0.1W; id: 2069; source_package: R_1K_1P_0603; TableName: viewAltiumResistors; Height: .55MM; MFG_PN: ERJ-3EKF1822V; status: Unknown
R86 R88 = ERJ-3GEYJ101V: RES 100 OHM 1/10W 5% 0603 SMD; part_type: resistor; Tolerance: 5.00%; DIST: DIGIKEY; MFG: PANASONIC; DIST_PN: P100GCT-ND; id: 1685; source_package: R_100_0603_1P; TableName: viewAltiumResistors; Height: .55MM; MFG_PN: ERJ-3GEYJ101V; status: Unknown
R87 = PMR10EZPFU10L0: RES 0.01 OHM 1/2W 1% 0805 SMD; part_type: resistor; DIST: DIGIKEY; MFG: Rohm Semiconductor; DIST_PN: RHM.010AJCT-ND; Power: 0.5W; id: 2182; source_package: R_ 0.01_0.1P_0805; TableName: viewAltiumResistors; Tolerance: 1%; Height: 0.43MM; MFG_PN: PMR10EZPFU10L0; status: Unknown
TP10-TP12 TP78-TP82 TP84 = TP0042: TESTPOINT, 1MM SMD, Square pad, Round SM opening; part_type: test_point; mfg_pn: TP0042; mfg: NA; id: 888; TableName: viewAltiumMisc; dist: NA; dist_pn: NA; source_package: tp_smt; status: Unknown
TP39-TP41 TP75 TP77 = TPC150H080P: TESTPOINT, 1.5mm pad, 0.8 mm plated; part_type: test_point; id: 1236; mfg: NA; TableName: viewAltiumMisc; mfg_pn: TPC150H080P; dist: NA; dist_pn: NA; source_package: TPC150H080P; height: .05MM; status: Unknown
U1 = USBULC6-2M6: TVS DIODE 5VWM 17VC 6VFQFPN; part_type: ic; id: 2369; mfg: ST; dist: Digi-Key; dist_pn: 497-7044-1-ND; TableName: viewAltiumIcs; mfg_pn: USBULC6-2M6; source_package: USBULC6-2M6; height: 0.6mm; status: Good
U15 = BQ24297RGET: IC LI+ CHARGER PWR MGMT 24VQFN; id: 2425; mfg: TI; dist: Digikey; dist_pn: 296-39580-1-ND; TableName: viewAltiumIcs; mfg_pn: BQ24297RGET; part_type: ic; source_package: BQ24297; height: 1mm; status: Unknown; datasheet: http://www.ti.com/lit/ds/symlink/bq24297.pdf
U17 = BQ27520YZFR-G4: IC BATT FUEL GAUGE LIION 15DSBGA; id: 2402; mfg: TI; dist: Digikey; dist_pn: 296-38882-1-ND; TableName: viewAltiumIcs; mfg_pn: BQ27520YZFR-G4; part_type: ic; source_package: BQ27520YZFR-G4; height: .625mm; status: Unknown; datasheet: http://www.ti.com/lit/ds/symlink/bq27520-g4.pdf

## Sheet Regulation.SchDoc: Regulation
size 431 x 279 mm; DrawnBy: D. Bruey, M. Ciuffo; Organization: Synapse Product Development, LLC.; Address1: 1511 6th Ave., Suite 400; Address2: Seattle, Washington 98101; Address3: 206.381.0898; Address4: www.synapse.com; DocumentNumber: 14; SheetNumber: 6; SheetTotal: 7; PageSetup: Record=PageOptions|CenterHorizontal=True|CenterVertical=True|PrintScale=1.06|XCorrection=1.00|YCorrection=1.00|PrintKind=1|BorderSize=5000000|LeftOffset=0|BottomOffset=0|Orientation=2|PaperLength=4318|PaperWidth=2794|Scale=100|PaperSource=7|PrintQuality=200|MediaType=1|DitherType=10|PrintScaleMode=1|PaperKind=11x17|PaperIndex=3
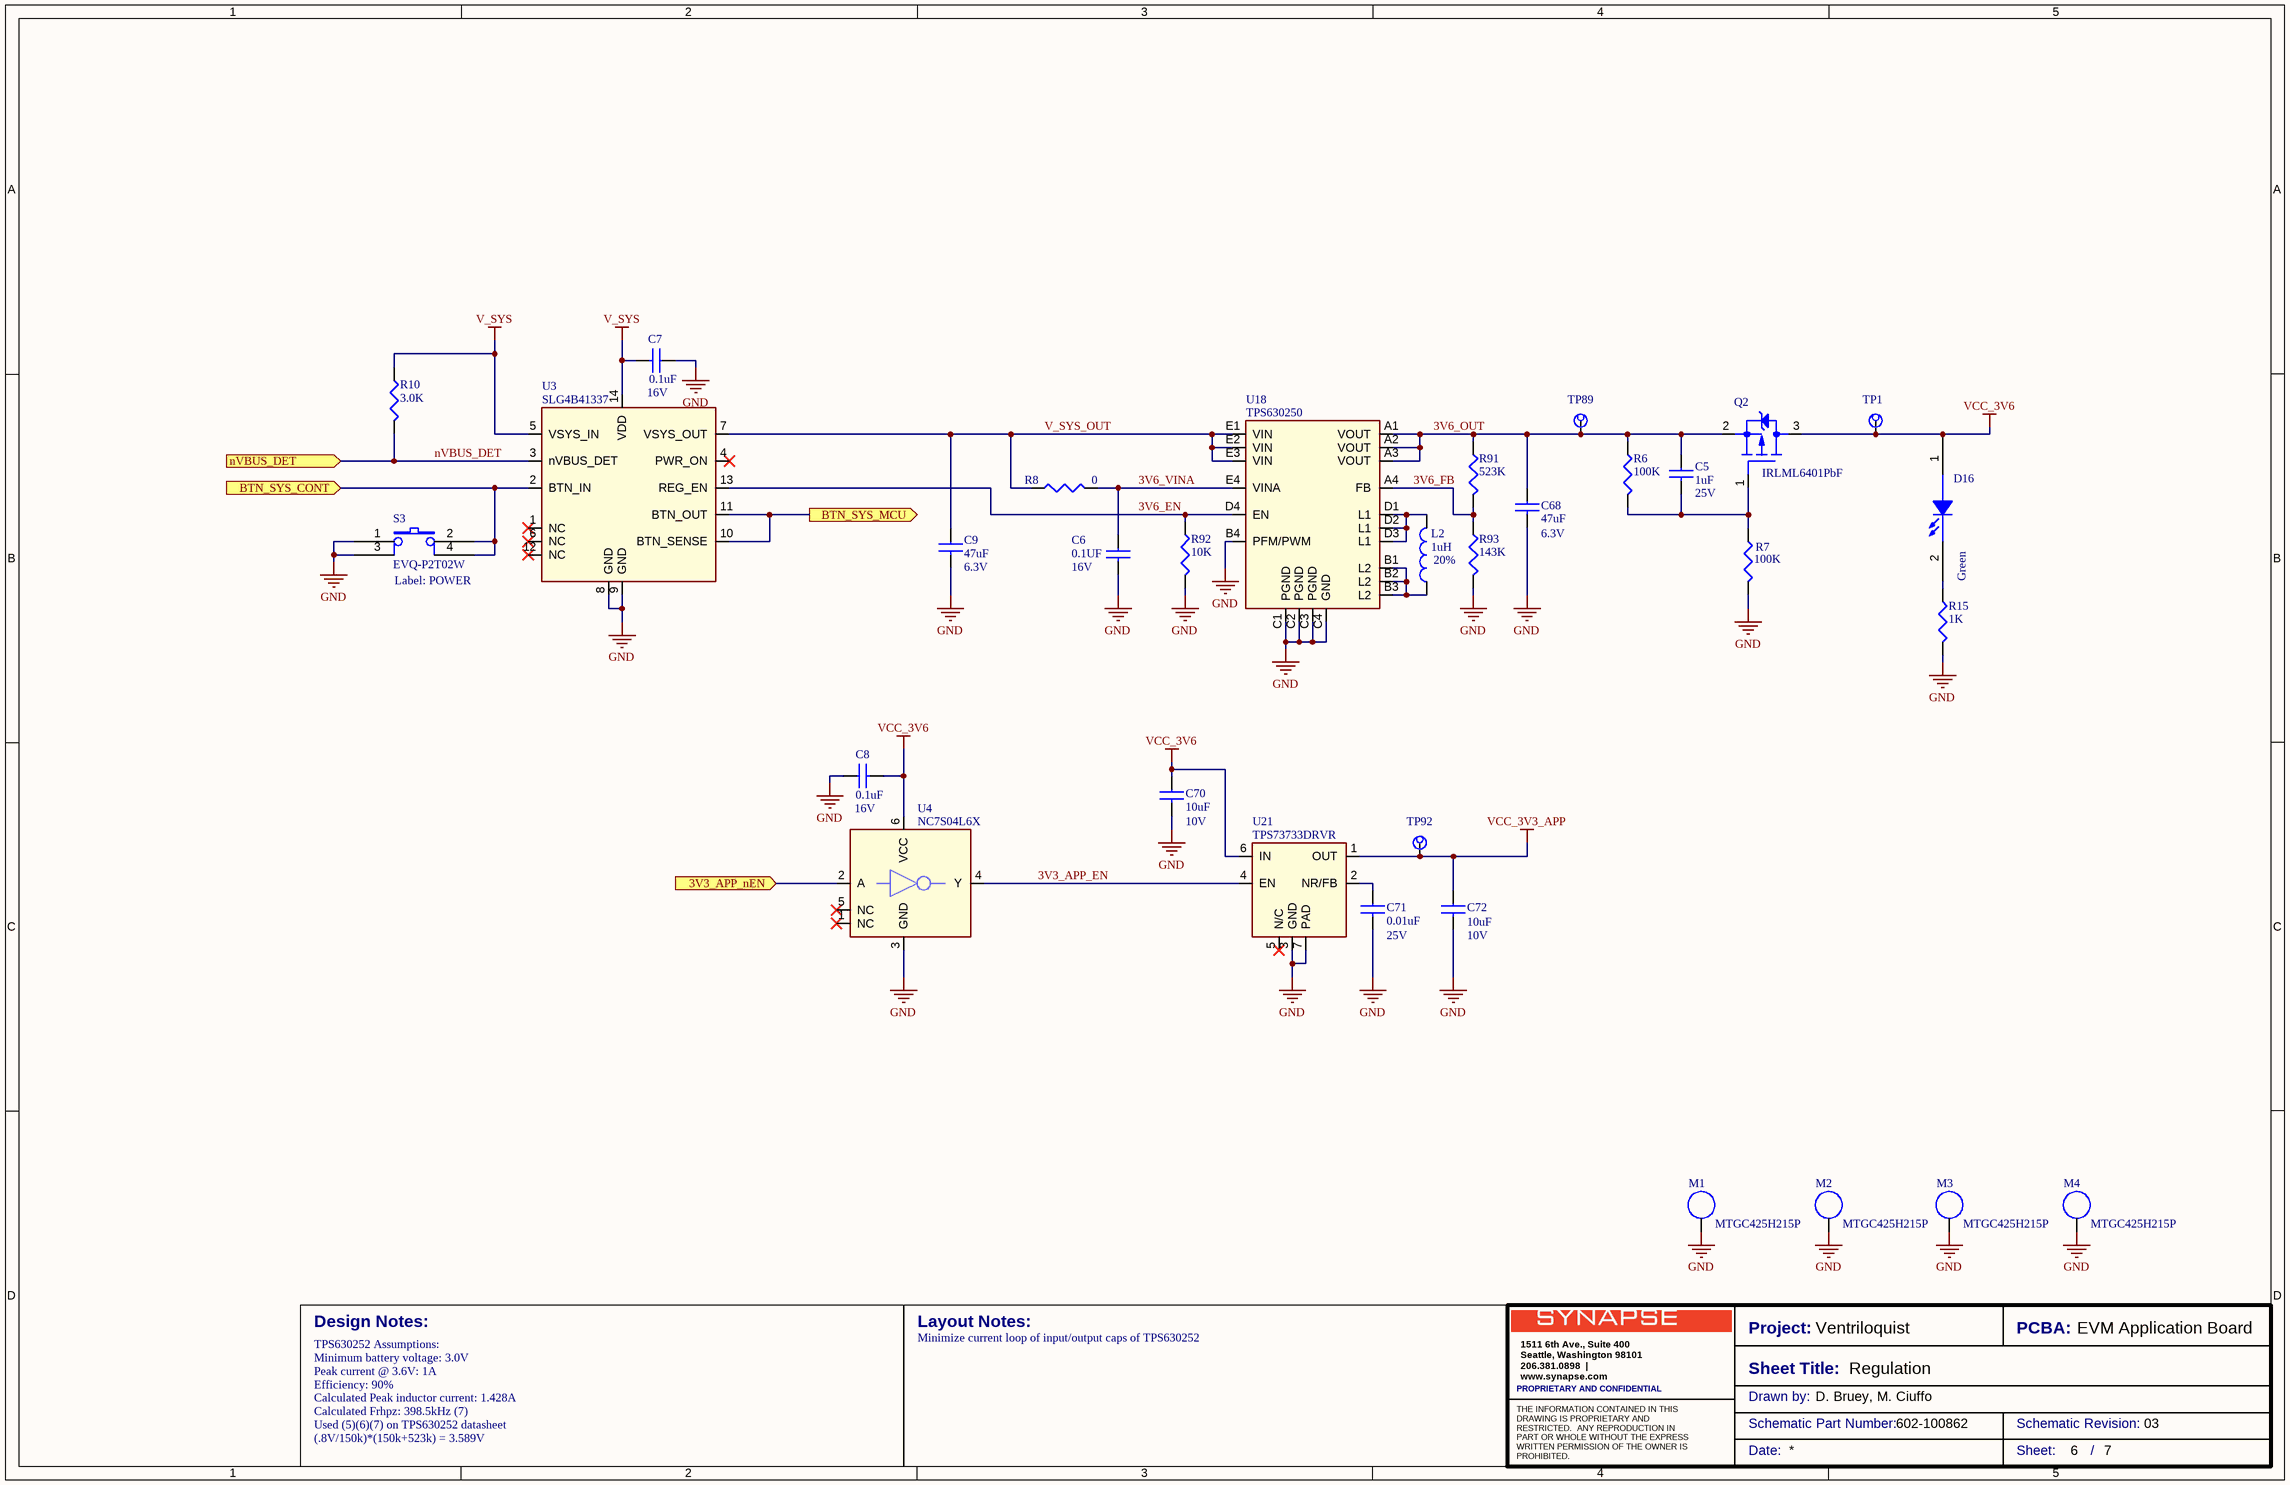
[diagram p4: Regulation.SchDoc]

### Parts
C5  1uF  Voltage: 25V  [0603-IPCsm_90]
C6  0.1UF  Voltage: 16V  [0603-ipcsm_90]
C7  0.1uF  Voltage: 16V  [0402-IPCsm_55]
C8  0.1uF  Voltage: 16V  [0402-IPCsm_55]
C9  47uF  Voltage: 6.3V  [0805-ipcsm_145]
C68  47uF  Voltage: 6.3V  [0805-ipcsm_145]
C70  10uF  Voltage: 10V  [0603-IPCsm_90]
C71  0.01uF  Voltage: 25V  [0402-IPCsm_55]
C72  10uF  Voltage: 10V  [0603-IPCsm_90]
D16  Green  [led_ltst-c191kgkt_s80]
L2  1uH  Tolerance: 20%  [ind-1008_35H]
M1  MTGC425H215P  [MTGC425H215P]  (no BOM)
M2  MTGC425H215P  [MTGC425H215P]  (no BOM)
M3  MTGC425H215P  [MTGC425H215P]  (no BOM)
M4  MTGC425H215P  [MTGC425H215P]  (no BOM)
Q2  IRLML6401PbF  [SOT23_112]
R6  100K  [0402-IPCsm_40]
R7  100K  [0402-IPCsm_40]
R8  0  [0402-IPCsm_40]
R10  3.0K  [0402-IPCsm_40]
R15  1K  [0603-IPCsm_56]
R91  523K  [0402-IPCsm_40]
R92  10K  [0402-IPCsm_40]
R93  143K  [0402-IPCsm_40]
S3  EVQ-P2T02W  [SW_EVQP2]
TP1  TPC150H080P  [TPC150H080P]  (value not drawn)  (no BOM)
TP89  TPC150H080P  [TPC150H080P]  (value not drawn)  (no BOM)
TP92  TPC150H080P  [TPC150H080P]  (value not drawn)  (no BOM)
U3  SLG4B41337  [stqfn14_250x160x60]
U4  NC7S04L6X  [DFN6-NC7S04_110H]
U18  TPS630250  [bga20_tps630252-YFF]
U21  TPS73733DRVR  [SON6_TPS73733DRV]

### Ports
3V3_APP_nEN (in), BTN_SYS_CONT (in), BTN_SYS_MCU (out), nVBUS_DET (in)

### Nets
GND: C6.2 C7.1 C8.1 C9.2 C68.2 C70.2 C71.2 C72.2 M1.1 M2.1 M3.1 M4.1 R7.2 R15.2 R92.2 R93.2 S3.1 S3.3 U3.8(GND) U3.9(GND) U4.3(GND) U18.B4(PFM/PWM) U18.C1(PGND) U18.C2(PGND) U18.C3(PGND) U18.C4(GND) U21.3(GND) U21.7(PAD)
V_SYS: C7.2 R10.1 U3.5(VSYS_IN) U3.14(VDD)
VCC_3V3_APP: C72.1 TP92.1(TP) U21.1(OUT)
VCC_3V6: C8.2 C70.1 D16.1(A) Q2.3(D) TP1.1(TP) U4.6(VCC) U21.6(IN)
3V3_APP_EN: U4.4(Y) U21.4(EN)
3V3_APP_nEN: U4.2(A) ; port 3V3_APP_nEN
3V6_EN: R92.1 U3.13(REG_EN) U18.D4(EN)
3V6_FB: R91.2 R93.1 U18.A4(FB)
3V6_OUT: C5.1 C68.1 Q2.2(S) R6.1 R91.1 TP89.1(TP) U18.A1(VOUT) U18.A2(VOUT) U18.A3(VOUT)
3V6_VINA: C6.1 R8.2 U18.E4(VINA)
BTN_SYS_CONT: S3.2 S3.4 U3.2(BTN_IN) ; port BTN_SYS_CONT
BTN_SYS_MCU: U3.10(BTN_SENSE) U3.11(BTN_OUT) ; port BTN_SYS_MCU
nVBUS_DET: R10.2 U3.3(nVBUS_DET) ; port nVBUS_DET
V_SYS_OUT: C9.1 R8.1 U3.7(VSYS_OUT) U18.E1(VIN) U18.E2(VIN) U18.E3(VIN)
NetC5_2: C5.2 Q2.1(G) R6.2 R7.1
NetC71_1: C71.1 U21.2(NR/FB)
NetD16_2: D16.2(C) R15.1
NetL2_1: L2.1 U18.B1(L2) U18.B2(L2) U18.B3(L2)
NetL2_2: L2.2 U18.D1(L1) U18.D2(L1) U18.D3(L1)

Not connected (* = marked no-connect by the designer): U3 1(NC)* 4(PWR_ON)* 6(NC)* 12(NC)*; U4 1(NC)* 5(NC)*; U21 5(N/C)*

### Notes on the sheet
- (near S3) Label: POWER
- Minimum battery voltage: 3.0V
- TPS630252 Assumptions:
- Peak current @ 3.6V: 1A
- Minimize current loop of input/output caps of TPS630252
- Calculated Peak inductor current: 1.428A
- Used (5)(6)(7) on TPS630252 datasheet
- Efficiency: 90%
- Calculated Frhpz: 398.5kHz (7)
- (.8V/150k)*(150k+523k) = 3.589V
- Design Notes:
- Layout Notes:
- Project:
- Sheet Title:
- PCBA:
- PROPRIETARY AND CONFIDENTIAL
- Drawn by:
- Schematic Part Number:
- Schematic Revision:
- Date:
- Sheet:
- /

### Library data of the parts
C5 = GRM188R61E105KA12D: as C52 on sheet Charging; mfg_pn: GRM188R61E105KA12D; type: X5R; tolerance: 10%; height: 0.9MM; status: Good
C6 = C0603C104J4RACTU: as C62 on sheet Charging; mfg_pn: C0603C104J4RACTU; type: X7R; height: 0.87MM; status: Unknown; tolerance: 5%
C7 C8 = GRM155R71C104KA88D: as C1 on sheet Charging; mfg_pn: GRM155R71C104KA88D; type: X7R; height: 0.55MM; status: Unknown
C9 C68 = C2012X5R0J476M125AC: as C4 on sheet Charging; mfg_pn: C2012X5R0J476M125AC; tolerance: 20%; height: 1.45MM; status: Unknown
C70 C72 = C1608X5R1A106K080AC: CAP CER 10UF 10V 10% X5R 0603; part_type: capacitor; id: 1203; mfg: TDK; dist: Digikey; dist_pn: 445-7486-6-ND; TableName: viewAltiumCapacitors; mfg_pn: C1608X5R1A106K080AC; type: X5R; tolerance: 10%; height: 0.9MM; status: Good
C71 = GRM155R71E103KA01D: CAP, 0.01 uF, 25V, 10%, 0402, X7R; part_type: capacitor; id: 620; mfg: MURATA; dist: DIGIKEY; dist_pn: 490-1312-1-ND; source_package: C_0.01u_25V_X7R_0402; TableName: viewAltiumCapacitors; mfg_pn: GRM155R71E103KA01D; type: X7R; tolerance: 10%; height: 0.55MM; status: Unknown
D16 = LTST-C191KGKT: as D8 on sheet Charging; mfg_pn: LTST-C191KGKT; source_package: LTST-C191KGKT; status: Good; height: 0.55mm; type: LED
L2 = LQM2HPN1R0MG0L: as L1 on sheet Charging; mfg_pn: LQM2HPN1R0MG0L; part_type: inductor; height: 0.80MM; status: Unknown
M1-M4 = MTGC425H215P: MTG, 4.25mm PAD, 2.15mm Plated Hole; part_type: mounting; id: 1240; dist_pn: None; TableName: viewAltiumMisc; mfg_pn: MTGC425H215P; height: 0.05MM; status: Unknown
Q2 = IRLML6401TRPBF: MOSFET P-CH 12V 4.3A SOT-23; part_type: fet; id: 567; mfg: International Rectifier; dist: DIGIKEY; dist_pn: IRLML6401PBFCT-ND; TableName: viewAltiumDiscretes; mfg_pn: IRLML6401TRPBF; source_package: IRLML6401PbF; height: 1.12MM; status: Unknown
R6 R7 = ERJ-2GEJ104X: RES 100K OHM 1/16W 5% 0402 SMD; part_type: resistor; Tolerance: 5.00%; DIST: DIGIKEY; MFG: PANASONIC; DIST_PN: P100KJCT-ND; Power: 0.063W; id: 1155; source_package: R_100K_5P_0402; TableName: viewAltiumResistors; Height: 0.4MM; MFG_PN: ERJ-2GEJ104X; status: Unknown
R8 = ERJ-2GE0R00X: as R74 on sheet Charging; Height: 0.4MM; MFG_PN: ERJ-2GE0R00X; status: Unknown
R10 = ERJ-2RKF3001X: RES 3.00K OHM 1/16W 1% 0402 SMD; part_type: resistor; Tolerance: 1.00%; Voltage: 50V; DIST: DIGIKEY; MFG: PANASONIC; DIST_PN: P3.00KLCT-ND; Power: 0.063W; id: 1306; source_package: R_3K_0402_1P; TableName: viewAltiumResistors; Height: .4MM; MFG_PN: ERJ-2RKF3001X; status: Unknown
R15 = RC0603FR-071KL: as R13 on sheet Charging; Type: "; Height: 0.5MM; MFG_PN: RC0603FR-071KL; status: Unknown
R91 = ERJ-2RKF5233X: RES SMD 523K OHM 1% 1/10W 0402; part_type: resistor; Tolerance: 0.1%; DIST: DIGIKEY; MFG: PANASONIC; DIST_PN: P523KLCT-ND; Power: 0.0625W; id: 2372; source_package: R_523K_0402_0p1; TableName: viewAltiumResistors; Height: 0.4mm; MFG_PN: ERJ-2RKF5233X; status: Unknown
R92 = ERJ-2GEJ103X: as R71 on sheet Charging; Tolerance: 5%; Height: 0.4mm; MFG_PN: ERJ-2GEJ103X; status: Unknown
R93 = ERJ-2RKF1433X: RES 143K OHM 1/16W 1% 0402 SMD; part_type: resistor; Tolerance: 1.00%; Voltage: 50V; DIST: DIGIKEY; MFG: PANASONIC; DIST_PN: P143KLCT-ND; Power: 0.063W; id: 1431; source_package: R_143K_1P_0402; TableName: viewAltiumResistors; Height: .4MM; MFG_PN: ERJ-2RKF1433X; status: Unknown
S3 = EVQ-P2T02W: SWITCH TACTILE SPST-NO 0.02A 15V; part_type: Misc; id: 1187; mfg: Panasonic; dist: Digikey; dist_pn: P11083SCT-ND; voltage: 15VDC; TableName: viewAltiumMisc; mfg_pn: EVQ-P2T02W; source_package: EVQ-P2T02W; height: 2.7mm; status: Unknown
TP1 TP89 TP92 = TPC150H080P: as TP39 on sheet Charging; mfg_pn: TPC150H080P; dist: NA; dist_pn: NA; source_package: TPC150H080P; height: .05MM; status: Unknown
U3 = SLG4B41337: GreenPAK Programmable Mixed Signal Array 14 pin; part_type: ic; id: 2531; mfg: Silego; TableName: viewAltiumIcs; mfg_pn: SLG4B41337; dist: Silego; dist_pn: SLG4B41337; height: 0.6mm; status: Good
U4 = NC7S04L6X: Inverter IC 1 Channel 6-MicroPak; id: 2521; mfg: Fairchild; dist: DIGIKEY; dist_pn: NC7S04L6XCT-ND; voltage: 2V-6V; TableName: viewAltiumIcs; mfg_pn: NC7S04L6X; part_type: ic; height: 0.55mm; status: Unknown
U18 = TPS630250YFFT: IC REG BCK BST ADJ 2A/4A 20DSBGA; id: 2407; mfg: TI; dist: Digikey; dist_pn: 296-37880-1-ND; voltage: 2.3V~5.5V; TableName: viewAltiumIcs; mfg_pn: TPS630250YFFT; part_type: ic; source_package: TPS630250YFFT; height: 1mm; power: 2A/4A; status: Unknown; datasheet: http://www.ti.com/lit/ds/symlink/tps630250.pdf
U21 = TPS73733DRVR: IC REG LDO 3.3V 1A 6SON; id: 2409; mfg: TI; dist: DIGIKEY; dist_pn: 296-40960-1-ND; voltage: 2.2V~5.5V; TableName: viewAltiumIcs; mfg_pn: TPS73733DRVR; part_type: ic; source_package: TPS73733DRVR; height: .8mm; power: 1A; status: Unknown; datasheet: http://www.ti.com/lit/ds/symlink/tps737.pdf

## Sheet Breakout.SchDoc: MCU Breakout
size 431 x 279 mm; DrawnBy: D. Bruey, M. Ciuffo; Organization: Synapse Product Development, LLC.; Address1: 1511 6th Ave., Suite 400; Address2: Seattle, Washington 98101; Address3: 206.381.0898; Address4: www.synapse.com; DocumentNumber: 15; SheetNumber: 4; SheetTotal: 7; PageSetup: Record=PageOptions|CenterHorizontal=True|CenterVertical=True|PrintScale=1.06|XCorrection=1.00|YCorrection=1.00|PrintKind=1|BorderSize=5000000|LeftOffset=0|BottomOffset=0|Orientation=2|PaperLength=4318|PaperWidth=2794|Scale=100|PaperSource=7|PrintQuality=200|MediaType=1|DitherType=10|PrintScaleMode=1|PaperKind=11x17|PaperIndex=3
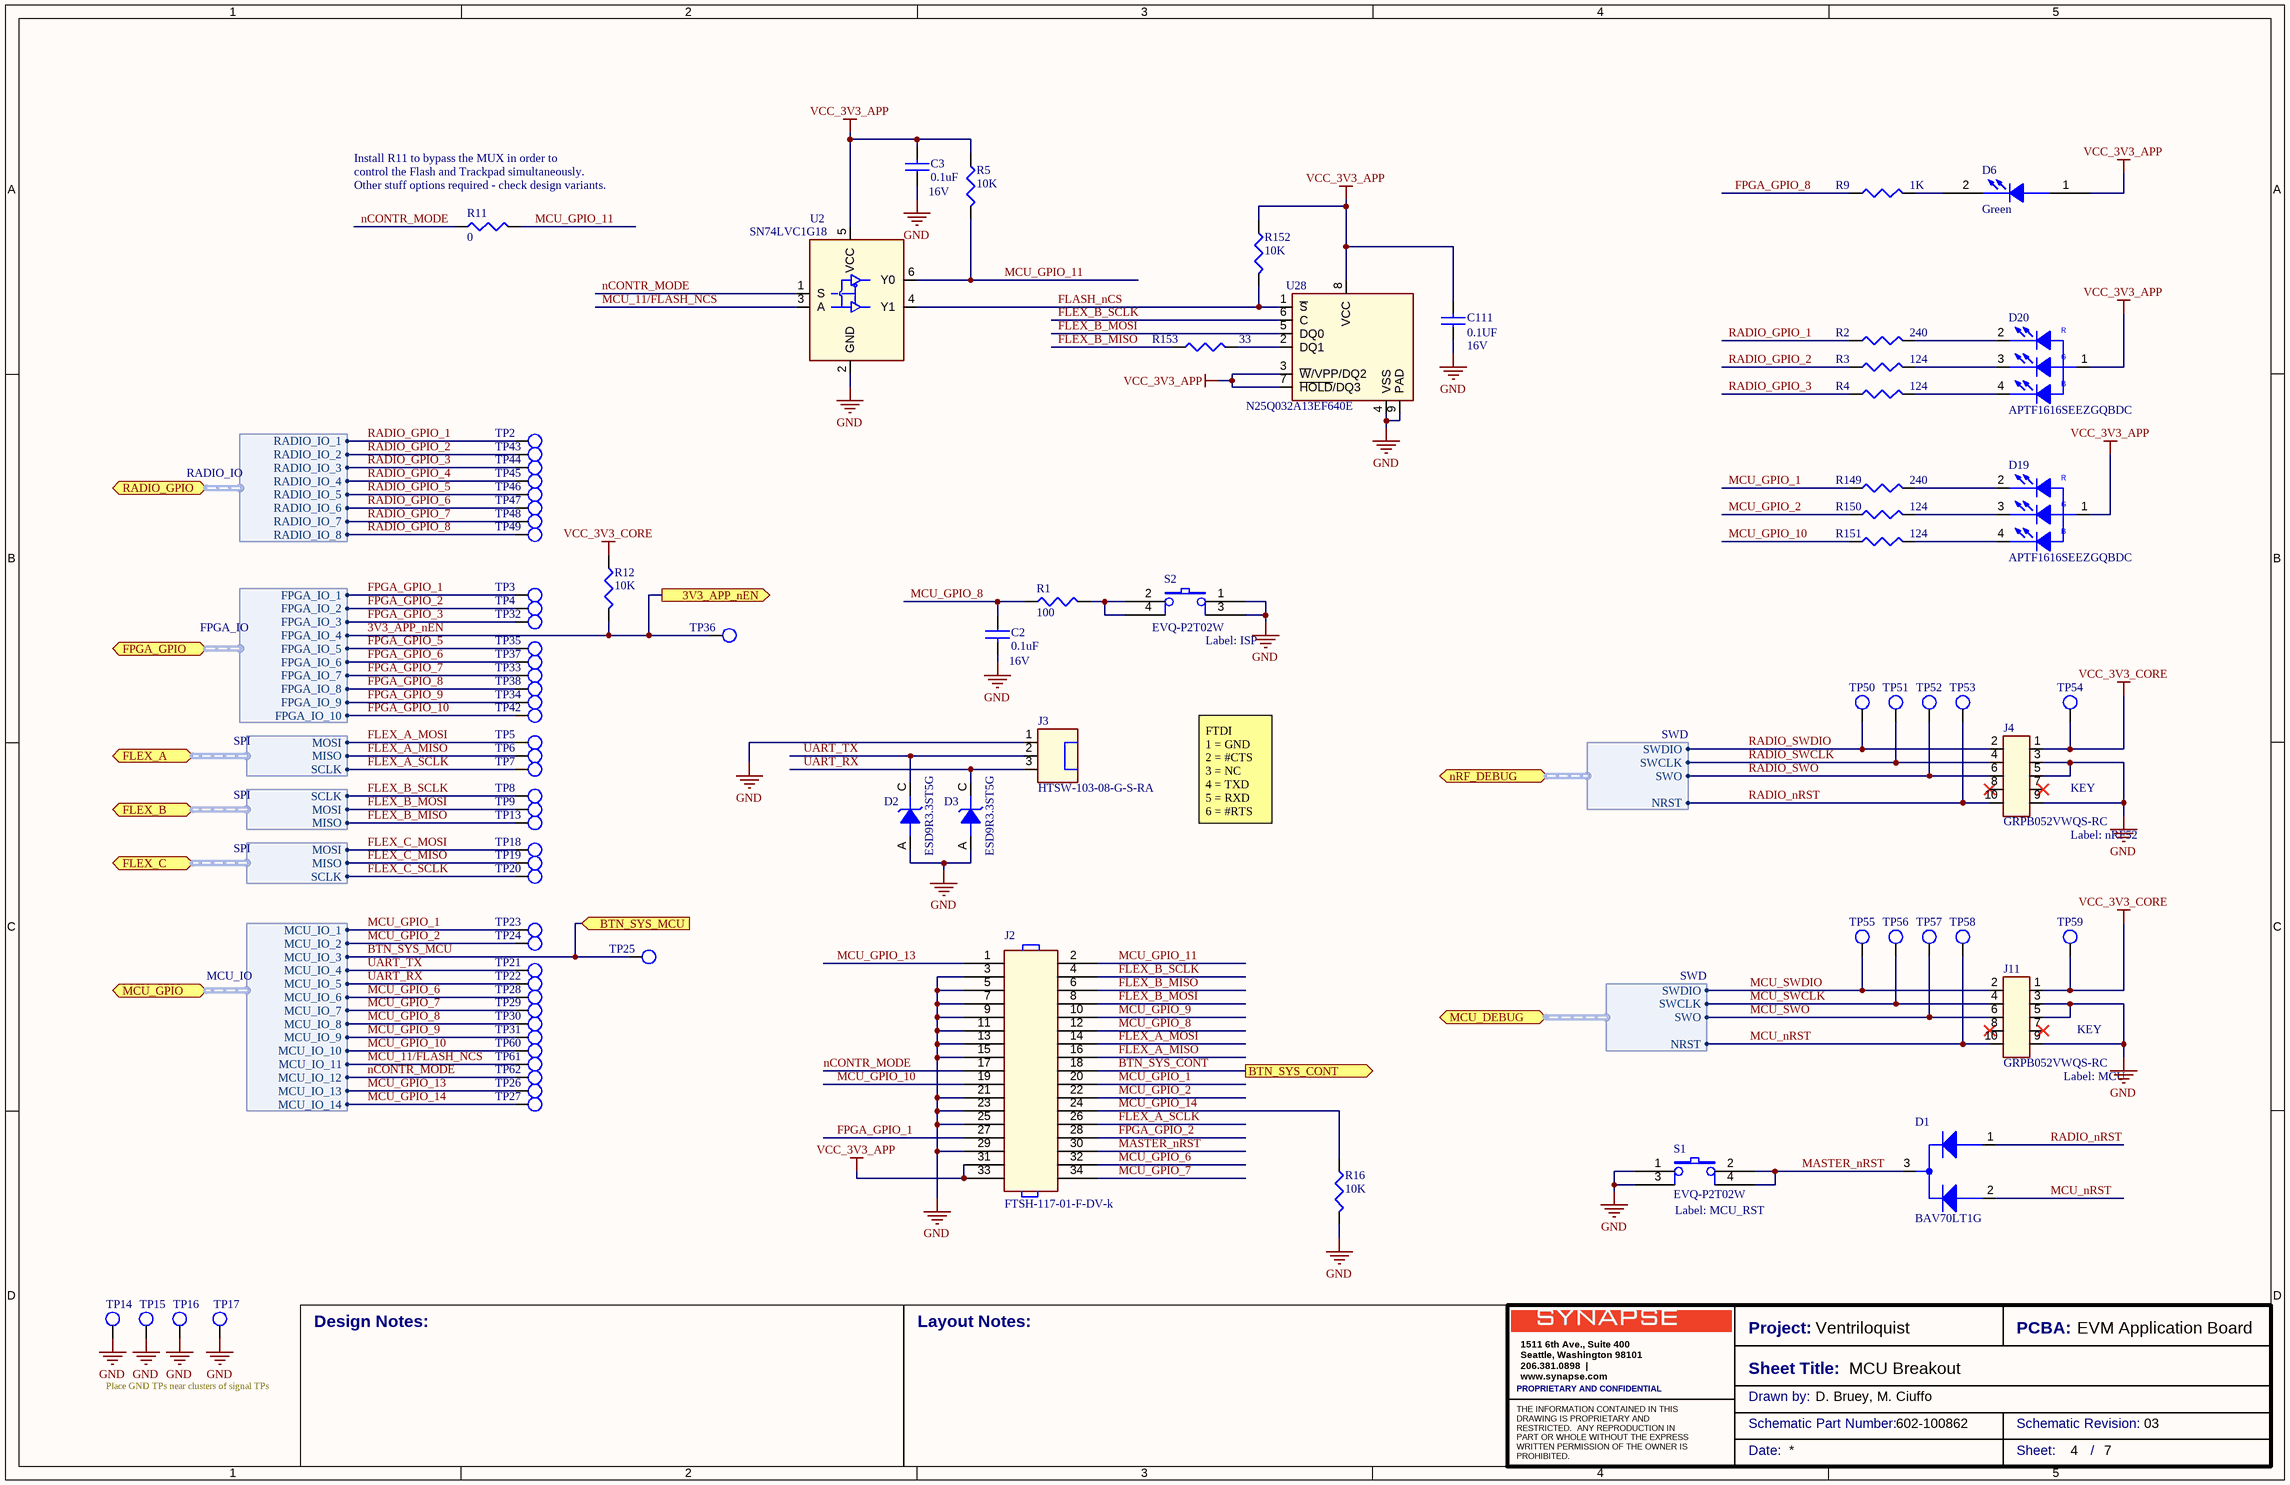
[diagram p5: Breakout.SchDoc]

### Parts
C2  0.1uF  Voltage: 16V  [0402-IPCsm_55]
C3  0.1uF  Voltage: 16V  [0402-IPCsm_55]
C111  0.1UF  Voltage: 16V  [0603-ipcsm_90]
D1  BAV70LT1G  [SOT23_44H]
D2  ESD9R3.3ST5G  [sod923-40]
D3  ESD9R3.3ST5G  [sod923-40]
D6  Green  [led_ltst-c191kgkt_s80]
D19  APTF1616SEEZGQBDC  [led_RBG_1p6x1p6_sm]
D20  APTF1616SEEZGQBDC  [led_RBG_1p6x1p6_sm]
J2  FTSH-117-01-F-DV-k  [FTSH-117-01-XXX-DV-K]
J3  HTSW-103-08-G-S-RA  [CON_HDR_1X3_RA]
J4  GRPB052VWQS-RC  [con_hdr_2x5_smt_50l]
J11  GRPB052VWQS-RC  [con_hdr_2x5_smt_50l]
R1  100  [0402-IPCsm_40]
R2  240  [0402-IPCsm_40]
R3  124  [0402-IPCsm_40]
R4  124  [0402-IPCsm_40]
R5  10K  [0402-IPCsm_40]
R9  1K  [0603-IPCsm_56]
R11  0  [0402-IPCsm_40]
R12  10K  [0402-IPCsm_40]
R16  10K  [0402-IPCsm_40]
R149  240  [0402-IPCsm_40]
R150  124  [0402-IPCsm_40]
R151  124  [0402-IPCsm_40]
R152  10K  [0402-IPCsm_40]
R153  33  [0402-IPCsm_40]
S1  EVQ-P2T02W  [SW_EVQP2]
S2  EVQ-P2T02W  [SW_EVQP2]
TP2  tp-1mm  [TP-S100_SMT]  (value not drawn)  (no BOM)
TP3  tp-1mm  [TP-S100_SMT]  (value not drawn)  (no BOM)
TP4  tp-1mm  [TP-S100_SMT]  (value not drawn)  (no BOM)
TP5  tp-1mm  [TP-S100_SMT]  (value not drawn)  (no BOM)
TP6  tp-1mm  [TP-S100_SMT]  (value not drawn)  (no BOM)
TP7  tp-1mm  [TP-S100_SMT]  (value not drawn)  (no BOM)
TP8  tp-1mm  [TP-S100_SMT]  (value not drawn)  (no BOM)
TP9  tp-1mm  [TP-S100_SMT]  (value not drawn)  (no BOM)
TP13  tp-1mm  [TP-S100_SMT]  (value not drawn)  (no BOM)
TP14  tp-1mm  [TP-S100_SMT]  (value not drawn)  (no BOM)
TP15  tp-1mm  [TP-S100_SMT]  (value not drawn)  (no BOM)
TP16  tp-1mm  [TP-S100_SMT]  (value not drawn)  (no BOM)
TP17  tp-1mm  [TP-S100_SMT]  (value not drawn)  (no BOM)
TP18  tp-1mm  [TP-S100_SMT]  (value not drawn)  (no BOM)
TP19  tp-1mm  [TP-S100_SMT]  (value not drawn)  (no BOM)
TP20  tp-1mm  [TP-S100_SMT]  (value not drawn)  (no BOM)
TP21  tp-1mm  [TP-S100_SMT]  (value not drawn)  (no BOM)
TP22  tp-1mm  [TP-S100_SMT]  (value not drawn)  (no BOM)
TP23  tp-1mm  [TP-S100_SMT]  (value not drawn)  (no BOM)
TP24  tp-1mm  [TP-S100_SMT]  (value not drawn)  (no BOM)
TP25  tp-1mm  [TP-S100_SMT]  (value not drawn)  (no BOM)
TP26  tp-1mm  [TP-S100_SMT]  (value not drawn)  (no BOM)
TP27  tp-1mm  [TP-S100_SMT]  (value not drawn)  (no BOM)
TP28  tp-1mm  [TP-S100_SMT]  (value not drawn)  (no BOM)
TP29  tp-1mm  [TP-S100_SMT]  (value not drawn)  (no BOM)
TP30  tp-1mm  [TP-S100_SMT]  (value not drawn)  (no BOM)
TP31  tp-1mm  [TP-S100_SMT]  (value not drawn)  (no BOM)
TP32  tp-1mm  [TP-S100_SMT]  (value not drawn)  (no BOM)
TP33  tp-1mm  [TP-S100_SMT]  (value not drawn)  (no BOM)
TP34  tp-1mm  [TP-S100_SMT]  (value not drawn)  (no BOM)
TP35  tp-1mm  [TP-S100_SMT]  (value not drawn)  (no BOM)
TP36  tp-1mm  [TP-S100_SMT]  (value not drawn)  (no BOM)
TP37  tp-1mm  [TP-S100_SMT]  (value not drawn)  (no BOM)
TP38  tp-1mm  [TP-S100_SMT]  (value not drawn)  (no BOM)
TP42  tp-1mm  [TP-S100_SMT]  (value not drawn)  (no BOM)
TP43  tp-1mm  [TP-S100_SMT]  (value not drawn)  (no BOM)
TP44  tp-1mm  [TP-S100_SMT]  (value not drawn)  (no BOM)
TP45  tp-1mm  [TP-S100_SMT]  (value not drawn)  (no BOM)
TP46  tp-1mm  [TP-S100_SMT]  (value not drawn)  (no BOM)
TP47  tp-1mm  [TP-S100_SMT]  (value not drawn)  (no BOM)
TP48  tp-1mm  [TP-S100_SMT]  (value not drawn)  (no BOM)
TP49  tp-1mm  [TP-S100_SMT]  (value not drawn)  (no BOM)
TP50  tp-1mm  [TP-S100_SMT]  (value not drawn)  (no BOM)
TP51  tp-1mm  [TP-S100_SMT]  (value not drawn)  (no BOM)
TP52  tp-1mm  [TP-S100_SMT]  (value not drawn)  (no BOM)
TP53  tp-1mm  [TP-S100_SMT]  (value not drawn)  (no BOM)
TP54  tp-1mm  [TP-S100_SMT]  (value not drawn)  (no BOM)
TP55  tp-1mm  [TP-S100_SMT]  (value not drawn)  (no BOM)
TP56  tp-1mm  [TP-S100_SMT]  (value not drawn)  (no BOM)
TP57  tp-1mm  [TP-S100_SMT]  (value not drawn)  (no BOM)
TP58  tp-1mm  [TP-S100_SMT]  (value not drawn)  (no BOM)
TP59  tp-1mm  [TP-S100_SMT]  (value not drawn)  (no BOM)
TP60  tp-1mm  [TP-S100_SMT]  (value not drawn)  (no BOM)
TP61  tp-1mm  [TP-S100_SMT]  (value not drawn)  (no BOM)
TP62  tp-1mm  [TP-S100_SMT]  (value not drawn)  (no BOM)
U2  SN74LVC1G18  [SON6_TI_DRY]
U28  N25Q032A13EF640E  [MLP8_N25Q032A_F6]

### Ports
3V3_APP_nEN (out), BTN_SYS_CONT (out), BTN_SYS_MCU (in), FLEX_A (harness SPI), FLEX_B (harness SPI), FLEX_C (harness SPI), FPGA_GPIO (harness FPGA_IO), MCU_DEBUG (harness SWD), MCU_GPIO (harness MCU_IO), nRF_DEBUG (harness SWD), RADIO_GPIO (harness RADIO_IO)

### Harnesses
SWD: NRST, SWCLK, SWDIO, SWO
MCU_IO: MCU_IO_2, MCU_IO_3, MCU_IO_4, MCU_IO_5, MCU_IO_6, MCU_IO_7, MCU_IO_8, MCU_IO_9, MCU_IO_10, MCU_IO_1, MCU_IO_11, MCU_IO_12, MCU_IO_13, MCU_IO_14
SPI: MOSI, MISO, SCLK
SWD: SWCLK, SWDIO, SWO, NRST
RADIO_IO: RADIO_IO_1, RADIO_IO_2, RADIO_IO_3, RADIO_IO_4, RADIO_IO_5, RADIO_IO_6, RADIO_IO_7, RADIO_IO_8
FPGA_IO: FPGA_IO_2, FPGA_IO_3, FPGA_IO_4, FPGA_IO_5, FPGA_IO_6, FPGA_IO_7, FPGA_IO_8, FPGA_IO_9, FPGA_IO_10, FPGA_IO_1

### Nets
GND: C2.2 C3.1 C111.1 D2.A D3.A J2.3 J2.5 J2.7 J2.9 J2.11 J2.13 J2.15 J2.21 J2.23 J2.25 J2.29 J3.1 J4.3 J4.5 J4.9 J11.3 J11.5 J11.9 R16.2 S1.1 S1.3 S2.1 S2.3 TP14.1(TP) TP15.1(TP) TP16.1(TP) TP17.1(TP) U2.2(GND) U28.4(VSS) U28.9(PAD)
VCC_3V3_APP: C3.2 C111.2 D6.1(A) D19.1(ANODE) D20.1(ANODE) J2.31 J2.33 R5.1 R152.1 U2.5(VCC) U28.3(~{W}/VPP/DQ2) U28.7(~{HOLD}/DQ3) U28.8(VCC)
VCC_3V3_CORE: J4.1 J11.1 R12.1 TP54.1(TP) TP59.1(TP)
3V3_APP_nEN: R12.2 TP36.1(TP) ; port 3V3_APP_nEN, port FPGA_GPIO.FPGA_IO_4
BTN_SYS_CONT: J2.18 ; port BTN_SYS_CONT
BTN_SYS_MCU: TP25.1(TP) ; port BTN_SYS_MCU, port MCU_GPIO.MCU_IO_3
FLASH_nCS: R152.2 U2.4(Y1) U28.1(~{S})
FLEX_A_MISO: J2.16 TP6.1(TP) ; port FLEX_A.MISO
FLEX_A_MOSI: J2.14 TP5.1(TP) ; port FLEX_A.MOSI
FLEX_A_SCLK: J2.26 TP7.1(TP) ; port FLEX_A.SCLK
FLEX_B_MISO: J2.6 R153.1 TP13.1(TP) ; port FLEX_B.MISO
FLEX_B_MOSI: J2.8 TP9.1(TP) U28.5(DQ0) ; port FLEX_B.MOSI
FLEX_B_SCLK: J2.4 TP8.1(TP) U28.6(C) ; port FLEX_B.SCLK
FLEX_C_MISO: TP19.1(TP) ; port FLEX_C.MISO
FLEX_C_MOSI: TP18.1(TP) ; port FLEX_C.MOSI
FLEX_C_SCLK: TP20.1(TP) ; port FLEX_C.SCLK
FPGA_GPIO_1: J2.27 TP3.1(TP) ; port FPGA_GPIO.FPGA_IO_1
FPGA_GPIO_2: J2.28 TP4.1(TP) ; port FPGA_GPIO.FPGA_IO_2
FPGA_GPIO_3: TP32.1(TP) ; port FPGA_GPIO.FPGA_IO_3
FPGA_GPIO_5: TP35.1(TP) ; port FPGA_GPIO.FPGA_IO_5
FPGA_GPIO_6: TP37.1(TP) ; port FPGA_GPIO.FPGA_IO_6
FPGA_GPIO_7: TP33.1(TP) ; port FPGA_GPIO.FPGA_IO_7
FPGA_GPIO_8: R9.2 TP38.1(TP) ; port FPGA_GPIO.FPGA_IO_8
FPGA_GPIO_9: TP34.1(TP) ; port FPGA_GPIO.FPGA_IO_9
FPGA_GPIO_10: TP42.1(TP) ; port FPGA_GPIO.FPGA_IO_10
MASTER_nRST: D1.3(A) J2.30 S1.2 S1.4
MCU_11/FLASH_NCS: TP61.1(TP) U2.3(A) ; port MCU_GPIO.MCU_IO_11
MCU_GPIO_1: J2.20 R149.1 TP23.1(TP) ; port MCU_GPIO.MCU_IO_1
MCU_GPIO_2: J2.22 R150.1 TP24.1(TP) ; port MCU_GPIO.MCU_IO_2
MCU_GPIO_6: J2.32 TP28.1(TP) ; port MCU_GPIO.MCU_IO_6
MCU_GPIO_7: J2.34 TP29.1(TP) ; port MCU_GPIO.MCU_IO_7
MCU_GPIO_8: C2.1 J2.12 R1.1 TP30.1(TP) ; port MCU_GPIO.MCU_IO_8
MCU_GPIO_9: J2.10 TP31.1(TP) ; port MCU_GPIO.MCU_IO_9
MCU_GPIO_10: J2.19 R151.1 TP60.1(TP) ; port MCU_GPIO.MCU_IO_10
MCU_GPIO_11: J2.2 R5.2 R11.2 U2.6(Y0)
MCU_GPIO_13: J2.1 TP26.1(TP) ; port MCU_GPIO.MCU_IO_13
MCU_GPIO_14: J2.24 R16.1 TP27.1(TP) ; port MCU_GPIO.MCU_IO_14
MCU_nRST: D1.2(C2) J11.10 TP58.1(TP) ; port MCU_DEBUG.NRST
MCU_SWCLK: J11.4 TP56.1(TP) ; port MCU_DEBUG.SWCLK
MCU_SWDIO: J11.2 TP55.1(TP) ; port MCU_DEBUG.SWDIO
MCU_SWO: J11.6 TP57.1(TP) ; port MCU_DEBUG.SWO
nCONTR_MODE: J2.17 R11.1 TP62.1(TP) U2.1(S) ; port MCU_GPIO.MCU_IO_12  [project net MCU_GPIO_12]
RADIO_GPIO_1: R2.1 TP2.1(TP) ; port RADIO_GPIO.RADIO_IO_1
RADIO_GPIO_2: R3.1 TP43.1(TP) ; port RADIO_GPIO.RADIO_IO_2
RADIO_GPIO_3: R4.1 TP44.1(TP) ; port RADIO_GPIO.RADIO_IO_3
RADIO_GPIO_4: TP45.1(TP) ; port RADIO_GPIO.RADIO_IO_4
RADIO_GPIO_5: TP46.1(TP) ; port RADIO_GPIO.RADIO_IO_5
RADIO_GPIO_6: TP47.1(TP) ; port RADIO_GPIO.RADIO_IO_6
RADIO_GPIO_7: TP48.1(TP) ; port RADIO_GPIO.RADIO_IO_7
RADIO_GPIO_8: TP49.1(TP) ; port RADIO_GPIO.RADIO_IO_8
RADIO_nRST: D1.1(C1) J4.10 TP53.1(TP) ; port nRF_DEBUG.NRST
RADIO_SWCLK: J4.4 TP51.1(TP) ; port nRF_DEBUG.SWCLK
RADIO_SWDIO: J4.2 TP50.1(TP) ; port nRF_DEBUG.SWDIO
RADIO_SWO: J4.6 TP52.1(TP) ; port nRF_DEBUG.SWO
UART_RX: D3.C J3.3 TP22.1(TP) ; port MCU_GPIO.MCU_IO_5  [project net MCU_GPIO_5]
UART_TX: D2.C J3.2 TP21.1(TP) ; port MCU_GPIO.MCU_IO_4  [project net MCU_GPIO_4]
NetD6_2: D6.2(C) R9.1
NetD19_2: D19.2(R) R149.2
NetD19_3: D19.3(G) R150.2
NetD19_4: D19.4(B) R151.2
NetD20_2: D20.2(R) R2.2
NetD20_3: D20.3(G) R3.2
NetD20_4: D20.4(B) R4.2
NetR1_2: R1.2 S2.2 S2.4
NetR153_2: R153.2 U28.2(DQ1)

Not connected (* = marked no-connect by the designer): J4 7* 8*; J11 7* 8*

### Notes on the sheet
- Install R11 to bypass the MUX in order to
- (near R11) control the Flash and Trackpad simultaneously.
- (near R11) Other stuff options required - check design variants.
- (near S2) Label: ISP
- FTDI
  1 = GND
  2 = #CTS
  3 = NC
  4 = TXD
  5 = RXD
  6 = #RTS
- (near J4) KEY
- (near J4) Label: nRF52
- (near J11) KEY
- (near J11) Label: MCU
- (near S1) Label: MCU_RST
- Place GND TPs near clusters of signal TPs
- Design Notes:
- Layout Notes:
- Project:
- Sheet Title:
- PCBA:
- PROPRIETARY AND CONFIDENTIAL
- Drawn by:
- Schematic Part Number:
- Schematic Revision:
- Date:
- Sheet:
- /

### Library data of the parts
C2 C3 = GRM155R71C104KA88D: as C1 on sheet Charging; mfg_pn: GRM155R71C104KA88D; type: X7R; height: 0.55MM; status: Unknown
C111 = C0603C104J4RACTU: as C62 on sheet Charging; mfg_pn: C0603C104J4RACTU; type: X7R; height: 0.87MM; status: Unknown; tolerance: 5%
D1 = BAV70LT1G: DIODE SWITCH DUAL CC 70V SOT23; id: 594; mfg: ON Semi; dist: Digikey; dist_pn: BAV70LT1GOSCT-ND; type: Standard; tolerance: na; power: 225mW; current: 200mA; TableName: viewAltiumDiscretes; mfg_pn: BAV70LT1G; part_type: diode; source_package: DIODE 2 CC; voltage: 70V; height: 1.1MM; status: Unknown
D2 D3 = ESD9R3.3ST5G: TVS DIODE 3.3VWM 7.8VC SOD923; id: 1102; mfg: On Semiconductor; dist: Digikey; dist_pn: ESD9R3.3ST5GOSCT-ND; voltage: 3.3V; TableName: viewAltiumDiscretes; mfg_pn: ESD9R3.3ST5G; part_type: tvs; type: TVS; status: Unknown; height: 0.4mm
D6 = LTST-C191KGKT: as D8 on sheet Charging; mfg_pn: LTST-C191KGKT; source_package: LTST-C191KGKT; status: Good; height: 0.55mm; type: LED
D19 D20 = APTF1616SEEZGQBDC: LED RGB CLEAR 0606 SMD; id: 1228; mfg: Kingbright; dist: Digikey; dist_pn: 754-1500-2-ND; current: 25mA; TableName: viewAltiumDiscretes; mfg_pn: APTF1616SEEZGQBDC; part_type: LED; source_package: LED; height: .7mm; status: Unknown
J2 = FTSH-117-01-F-DV-k: 34 Positions Header, Shrouded Connector 0.050" (1.27mm) Surface Mount Gold; id: 1653; mfg: Samtec; dist: Digikey; dist_pn: SAM8912-ND; positions: 34; TableName: viewAltiumConnectors; mfg_pn: FTSH-117-01-F-DV-K; part_type: connector; height: 5.97mm; status: Unknown
J3 = HTSW-103-08-G-S-RA: 3 Positions Header, Unshrouded Connector 0.100" (2.54mm) Through Hole, Right Angle Gold; id: 1657; mfg: Samtec; dist: DIGIKEY; dist_pn: SAM8924-ND; positions: 3; TableName: viewAltiumConnectors; mfg_pn: HTSW-103-08-G-S-RA; part_type: connector; height: 3.02mm; status: Unknown
J4 J11 = GRPB052VWQS-RC: CONN HEADER .050" 10PS DL SMD AU; part_type: Connector; id: 1425; mfg: Sullins Connector Solutions; dist: Digikey; dist_pn: S9012E-05-ND; TableName: viewAltiumConnectors; mfg_pn: GRPB052VWQS-RC; source_package: GRPB052VWQS-RC; type: Header; status: Good
R1 = MCR01MZPJ101: RES 100 OHM 5% 0402 SMD; part_type: resistor; Tolerance: 5.00%; DIST: DIGIKEY; MFG: ROHM; DIST_PN: RHM100JCT-ND; id: 1182; source_package: R_ 100_5P_0402; TableName: viewAltiumResistors; Height: 0.4MM; MFG_PN: MCR01MZPJ101; status: Unknown
R2 R149 = ERJ-2RKF2400X: RES 240 OHM 1/10W 1% 0402 SMD; part_type: resistor; DIST: Digikey; MFG: Panasonic; DIST_PN: P240LDKR-ND; Power: 0.1W; id: 2285; TableName: viewAltiumResistors; Tolerance: 1%; Height: 0.4mm; MFG_PN: ERJ-2RKF2400X; status: Good
R3 R4 R150 R151 = RC0402FR-07124RL: RES SMD 124 OHM 1% 1/16W 0402; part_type: resistor; Tolerance: 1.00%; DIST: DIGIKEY; MFG: Yageo; DIST_PN: 311-124LRCT-ND; Power: 0.0625W; id: 2370; TableName: viewAltiumResistors; Height: .4mm; MFG_PN: RC0402FR-07124RL; status: Unknown
R5 R12 R16 R152 = ERJ-2GEJ103X: as R71 on sheet Charging; Tolerance: 5%; Height: 0.4mm; MFG_PN: ERJ-2GEJ103X; status: Unknown
R9 = RC0603FR-071KL: as R13 on sheet Charging; Type: "; Height: 0.5MM; MFG_PN: RC0603FR-071KL; status: Unknown
R11 = ERJ-2GE0R00X: as R74 on sheet Charging; Height: 0.4MM; MFG_PN: ERJ-2GE0R00X; status: Unknown
R153 = ERJ-2GEJ330X: RES 33 OHM 1/16W 5% 0402 SMD; part_type: resistor; Tolerance: 5.00%; Voltage: 50V; DIST: DIGIKEY; MFG: PANASONIC; DIST_PN: P33JCT-ND; Power: 0.063W; id: 1154; source_package: R_33_0402_5P; TableName: viewAltiumResistors; Height: .4MM; MFG_PN: ERJ-2GEJ330X; status: Unknown
S1 S2 = EVQ-P2T02W: as S3 on sheet Regulation; mfg_pn: EVQ-P2T02W; source_package: EVQ-P2T02W; height: 2.7mm; status: Unknown
TP2-TP9 TP13-TP38 TP42-TP62 = TP0042: as TP10 on sheet Charging; dist: NA; dist_pn: NA; source_package: tp_smt; status: Unknown
U2 = SN74LVC1G18DRYR: IC SGL OPEN DRAIN BUFFER SC70-5; Manufacturer: TI; id: 2517; dist: DIGIKEY; dist_pn: 296-30526-1-ND; source_package: IC 1OF2 NON-INV DEMUX 3ST 6SON; TableName: viewAltiumIcs; mfg_pn: SN74LVC1G18DRYR; mfg: TI; part_type: ic; status: Good
U28 = N25Q032A13EF640E: IC FLASH 32MBIT 108MHZ 8VDFN; id: 2417; mfg: Micron; TableName: viewAltiumIcs; mfg_pn: N25Q032A13EF640E; dist: Micron; dist_pn: N25Q032A13EF640E; part_type: ic; source_package: N25Q032A13EF640E; status: Unknown; datasheet: http://www.micron.com/~/media/Documents/Products/Data%20Sheet/NOR%20Flash/Serial%20NOR/N25Q/n25q_32mb_3v_65nm.pdf